# EAGLE board omniproto (EAGLE 6.6.0), part 1 of 3
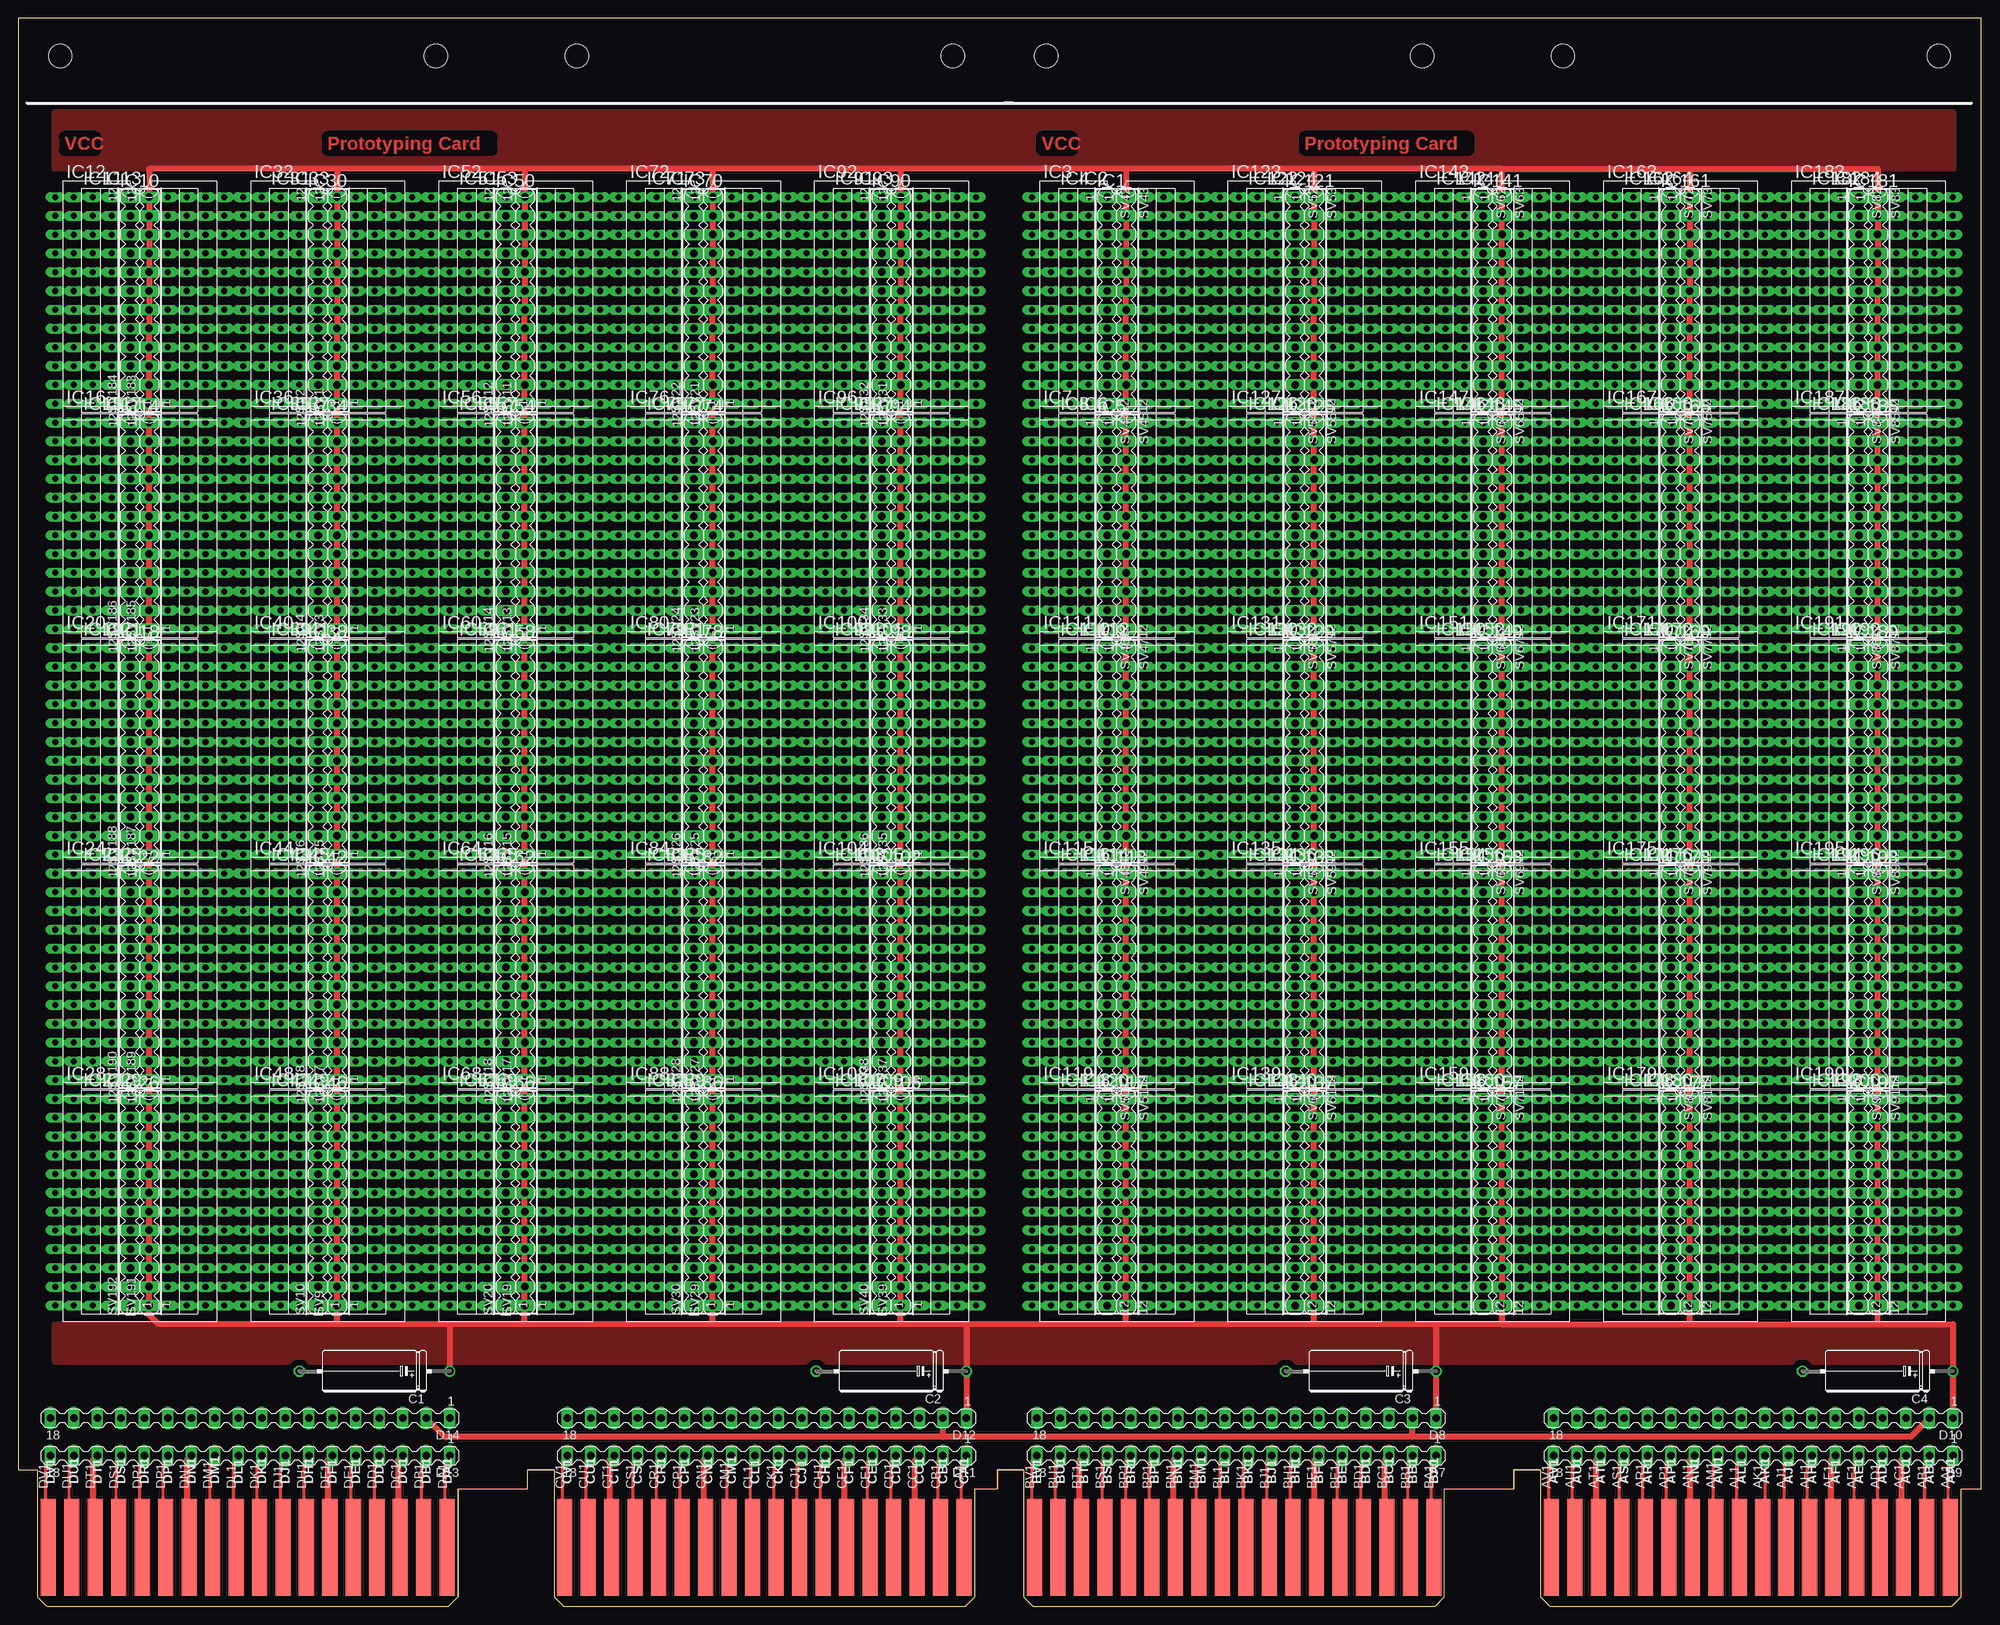
[diagram p3: board, top side]
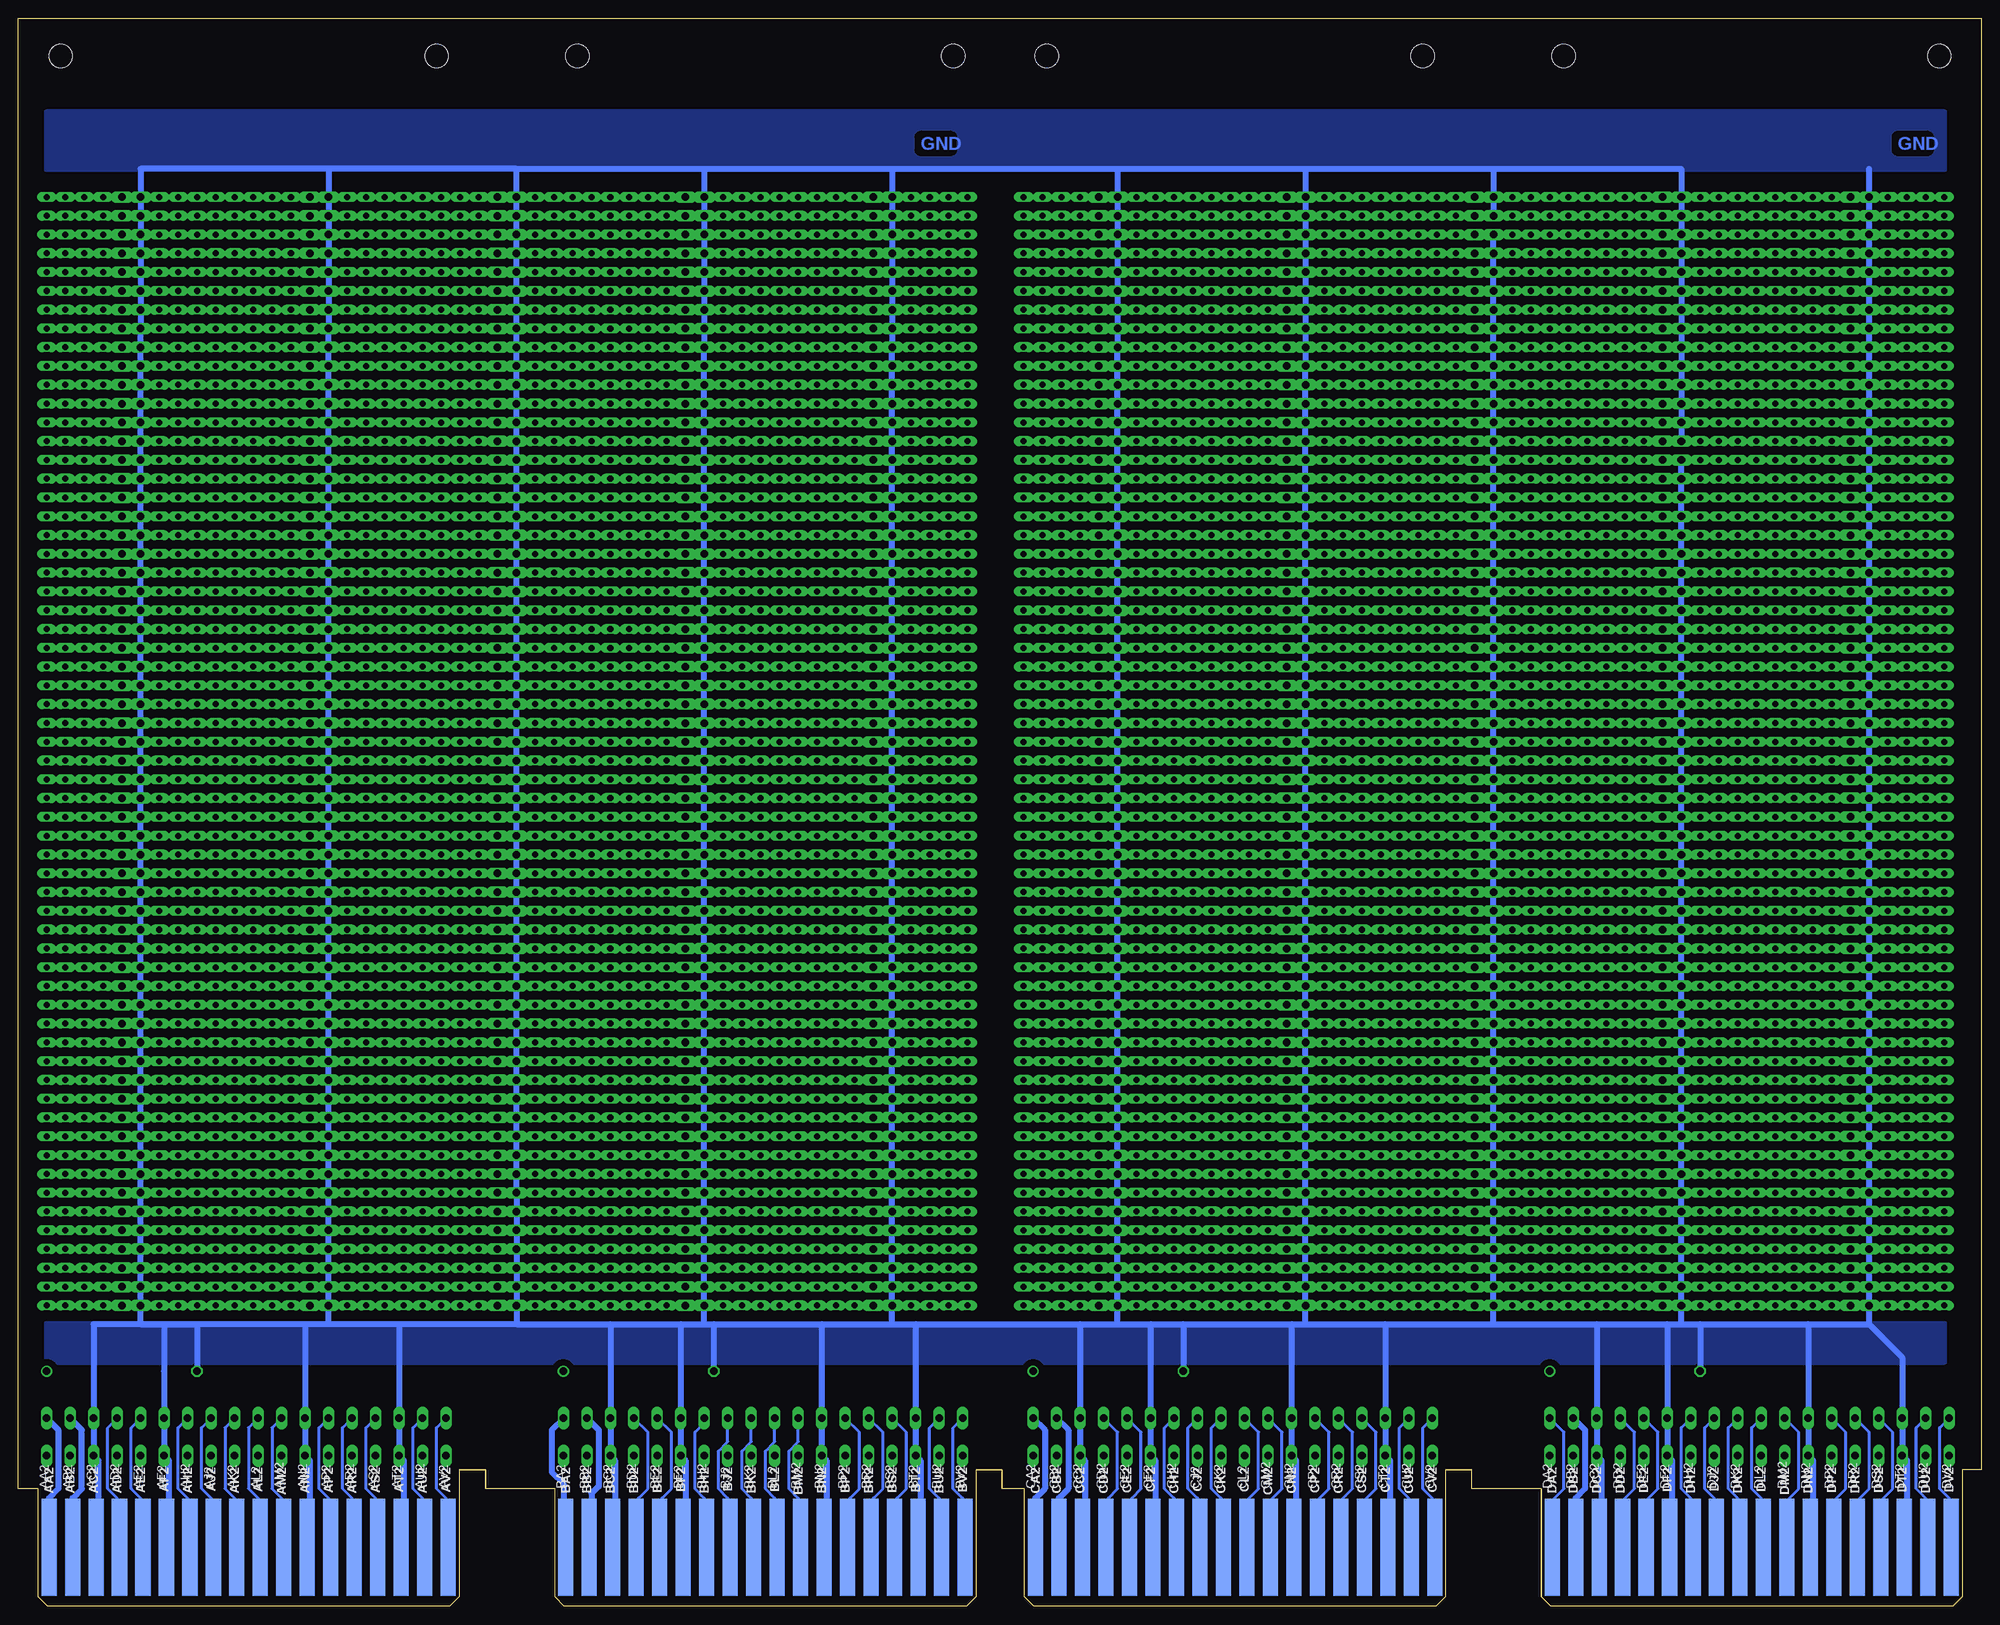
[diagram p4: board, bottom side, seen from below]

Size 265.3 x 214.63 mm. Coordinates in mm from the lower left corner, seen from the top.
Copper layers (1+16): Top 0.035mm / dielectric 1.5mm / Bottom 0.035mm
Design rules "16mils": minimum track width 16mil, minimum drill 32mil, track to track 15mil, track to pad 10mil, pad to pad 10mil, via to via 10mil, smd to smd 10mil, copper to edge 13mil, drill to drill 10mil, minimum pad ring 10mil, minimum via ring 8mil, stop-mask expansion 0mil, vias tented up to drill 0mil, thermal gap 10mil
Net classes: 1 supply: width 0.813 mm

## Footprints (pad centres in the part's own frame; a part is rotated, then mirrored left to right if it is on the bottom)
E12-8 = drill 1.016: + -10.16,0 | drill 1.016 octagon: - 10.16,0
MA18-1 = drill 1.016 long: 1 -25.4,0; 2 -22.225,0; 3 -19.05,0; 4 -15.875,0; 5 -12.7,0; 6 -9.525,0; 7 -6.35,0; 8 -3.175,0; 9 0,0; 10 3.175,0; 11 6.35,0; 12 9.525,0; 13 12.7,0; 14 15.875,0; 15 19.05,0; 16 22.225,0; 17 25.4,0; 18 28.575,0
DIL24-3 = drill 0.813 long: 1 -13.97,-3.81; 2 -11.43,-3.81; 3 -8.89,-3.81; 4 -6.35,-3.81; 5 -3.81,-3.81; 6 -1.27,-3.81; 7 1.27,-3.81; 8 3.81,-3.81; 9 6.35,-3.81; 10 8.89,-3.81; 11 11.43,-3.81; 12 13.97,-3.81; 13 13.97,3.81; 14 11.43,3.81; 15 8.89,3.81; 16 6.35,3.81; 17 3.81,3.81; 18 1.27,3.81; 19 -1.27,3.81; 20 -3.81,3.81; 21 -6.35,3.81; 22 -8.89,3.81; 23 -11.43,3.81; 24 -13.97,3.81
DIL24-6 = drill 0.813 long: 1 -13.97,-7.62; 2 -11.43,-7.62; 3 -8.89,-7.62; 4 -6.35,-7.62; 5 -3.81,-7.62; 6 -1.27,-7.62; 7 1.27,-7.62; 8 3.81,-7.62; 9 6.35,-7.62; 10 8.89,-7.62; 11 11.43,-7.62; 12 13.97,-7.62; 13 13.97,7.62; 14 11.43,7.62; 15 8.89,7.62; 16 6.35,7.62; 17 3.81,7.62; 18 1.27,7.62; 19 -1.27,7.62; 20 -3.81,7.62; 21 -6.35,7.62; 22 -8.89,7.62; 23 -11.43,7.62; 24 -13.97,7.62
DIL24-9 = drill 0.813 long: 1 -13.97,-11.43; 2 -11.43,-11.43; 3 -8.89,-11.43; 4 -6.35,-11.43; 5 -3.81,-11.43; 6 -1.27,-11.43; 7 1.27,-11.43; 8 3.81,-11.43; 9 6.35,-11.43; 10 8.89,-11.43; 11 11.43,-11.43; 12 13.97,-11.43; 13 13.97,11.43; 14 11.43,11.43; 15 8.89,11.43; 16 6.35,11.43; 17 3.81,11.43; 18 1.27,11.43; 19 -1.27,11.43; 20 -3.81,11.43; 21 -6.35,11.43; 22 -8.89,11.43; 23 -11.43,11.43; 24 -13.97,11.43
MA12-1 = drill 1.016 long: 1 -13.97,0; 2 -11.43,0; 3 -8.89,0; 4 -6.35,0; 5 -3.81,0; 6 -1.27,0; 7 1.27,0; 8 3.81,0; 9 6.35,0; 10 8.89,0; 11 11.43,0; 12 13.97,0
OMNIBUS = hole 3.175: 208.915,209.55; 259.715,209.55; 189.865,209.55; 139.065,209.55; 75.616,209.55; 126.416,209.55; 56.566,209.55; 5.766,209.55
EDGE-CON8 = smd 2.032 x 13.106: AA1 261.303,7.938; AB1 258.127,7.938; AC1 254.952,7.938; AD1 251.778,7.938; AE1 248.602,7.938; AF1 245.428,7.938; AH1 242.252,7.938; AJ1 239.077,7.938; AK1 235.903,7.938; AL1 232.727,7.938; AM1 229.553,7.938; AN1 226.377,7.938; AP1 223.202,7.938; AR1 220.028,7.938; AS1 216.852,7.938; AT1 213.678,7.938; AU1 210.502,7.938; AV1 207.327,7.938; BA1 191.452,7.938; BB1 188.278,7.938; BC1 185.102,7.938; BD1 181.928,7.938; BE1 178.752,7.938; BF1 175.577,7.938; BH1 172.403,7.938; BJ1 169.227,7.938; BK1 166.053,7.938; BL1 162.877,7.938; BM1 159.702,7.938; BN1 156.528,7.938; BP1 153.352,7.938; BR1 150.178,7.938; BS1 147.002,7.938; BT1 143.827,7.938; BU1 140.653,7.938; BV1 137.477,7.938; CA1 127.953,7.938; CB1 124.778,7.938; CC1 121.603,7.938; CD1 118.427,7.938; CE1 115.252,7.938; CF1 112.078,7.938; CH1 108.903,7.938; CJ1 105.728,7.938; CK1 102.552,7.938; CL1 99.377,7.938; CM1 96.203,7.938; CN1 93.028,7.938; CP1 89.853,7.938; CR1 86.677,7.938; CS1 83.502,7.938; CT1 80.328,7.938; CU1 77.153,7.938; CV1 73.978,7.938; DA1 58.102,7.938; DB1 54.928,7.938; DC1 51.752,7.938; DD1 48.578,7.938; DE1 45.403,7.938; DF1 42.227,7.938; DH1 39.053,7.938; DJ1 35.877,7.938; DK1 32.703,7.938; DL1 29.527,7.938; DM1 26.352,7.938; DN1 23.177,7.938; DP1 20.003,7.938; DR1 16.828,7.938; DS1 13.652,7.938; DT1 10.477,7.938; DU1 7.303,7.938; DV1 4.128,7.938 | smd 2.032 x 13.106 bottom: AA2 261.303,7.938; AB2 258.127,7.938; AC2 254.952,7.938; AD2 251.778,7.938; AE2 248.602,7.938; AF2 245.428,7.938; AH2 242.252,7.938; AJ2 239.077,7.938; AK2 235.903,7.938; AL2 232.727,7.938; AM2 229.553,7.938; AN2 226.377,7.938; AP2 223.202,7.938; AR2 220.028,7.938; AS2 216.852,7.938; AT2 213.678,7.938; AU2 210.502,7.938; AV2 207.327,7.938; BA2 191.452,7.938; BB2 188.278,7.938; BC2 185.102,7.938; BD2 181.928,7.938; BE2 178.752,7.938; BF2 175.577,7.938; BH2 172.403,7.938; BJ2 169.227,7.938; BK2 166.053,7.938; BL2 162.877,7.938; BM2 159.702,7.938; BN2 156.528,7.938; BP2 153.352,7.938; BR2 150.178,7.938; BS2 147.002,7.938; BT2 143.827,7.938; BU2 140.653,7.938; BV2 137.477,7.938; CA2 127.953,7.938; CB2 124.778,7.938; CC2 121.603,7.938; CD2 118.427,7.938; CE2 115.252,7.938; CF2 112.078,7.938; CH2 108.903,7.938; CJ2 105.728,7.938; CK2 102.552,7.938; CL2 99.377,7.938; CM2 96.203,7.938; CN2 93.028,7.938; CP2 89.853,7.938; CR2 86.677,7.938; CS2 83.502,7.938; CT2 80.328,7.938; CU2 77.153,7.938; CV2 73.978,7.938; DA2 58.102,7.938; DB2 54.928,7.938; DC2 51.752,7.938; DD2 48.578,7.938; DE2 45.403,7.938; DF2 42.227,7.938; DH2 39.053,7.938; DJ2 35.877,7.938; DK2 32.703,7.938; DL2 29.527,7.938; DM2 26.352,7.938; DN2 23.177,7.938; DP2 20.003,7.938; DR2 16.828,7.938; DS2 13.652,7.938; DT2 10.477,7.938; DU2 7.303,7.938; DV2 4.128,7.938

## Placement (x,y rotation side)
C1  [E12-8]  48.13,31.75 180 top
C2  [E12-8]  117.98,31.75 180 top
C3  [E12-8]  181.48,31.75 180 top
C4  [E12-8]  251.33,31.75 180 top
D7  MA18-1  [MA18-1]  166.24,20.32 180 top
D8  MA18-1  [MA18-1]  166.24,25.4 180 top
D9  MA18-1  [MA18-1]  236.09,20.32 180 top
D10  MA18-1  [MA18-1]  236.09,25.4 180 top
D11  MA18-1  [MA18-1]  102.74,20.32 180 top
D12  MA18-1  [MA18-1]  102.74,25.4 180 top
D13  MA18-1  [MA18-1]  32.89,20.32 180 top
D14  MA18-1  [MA18-1]  32.89,25.4 180 top
IC1  [DIL24-3]  148.46,176.53 270 top
IC2  [DIL24-6]  149.73,176.53 270 top
IC3  [DIL24-9]  148.46,176.53 270 top
IC4  [DIL24-6]  147.19,176.53 270 top
IC5  [DIL24-3]  148.46,146.05 270 top
IC6  [DIL24-6]  149.73,146.05 270 top
IC7  [DIL24-9]  148.46,146.05 270 top
IC8  [DIL24-6]  147.19,146.05 270 top
IC9  [DIL24-3]  148.46,115.57 270 top
IC10  [DIL24-3]  16.38,176.53 270 top
IC11  [DIL24-6]  15.11,176.53 270 top
IC12  [DIL24-9]  16.38,176.53 270 top
IC13  [DIL24-6]  17.65,176.53 270 top
IC14  [DIL24-3]  16.38,146.05 270 top
IC15  [DIL24-6]  15.11,146.05 270 top
IC16  [DIL24-9]  16.38,146.05 270 top
IC17  [DIL24-6]  17.65,146.05 270 top
IC18  [DIL24-3]  16.38,115.57 270 top
IC19  [DIL24-6]  15.11,115.57 270 top
IC20  [DIL24-9]  16.38,115.57 270 top
IC21  [DIL24-6]  17.65,115.57 270 top
IC22  [DIL24-3]  16.38,85.09 270 top
IC23  [DIL24-6]  15.11,85.09 270 top
IC24  [DIL24-9]  16.38,85.09 270 top
IC25  [DIL24-6]  17.65,85.09 270 top
IC26  [DIL24-3]  16.38,54.61 270 top
IC27  [DIL24-6]  15.11,54.61 270 top
IC28  [DIL24-9]  16.38,54.61 270 top
IC29  [DIL24-6]  17.65,54.61 270 top
IC30  [DIL24-3]  41.78,176.53 270 top
IC31  [DIL24-6]  40.51,176.53 270 top
IC32  [DIL24-9]  41.78,176.53 270 top
IC33  [DIL24-6]  43.05,176.53 270 top
IC34  [DIL24-3]  41.78,146.05 270 top
IC35  [DIL24-6]  40.51,146.05 270 top
IC36  [DIL24-9]  41.78,146.05 270 top
IC37  [DIL24-6]  43.05,146.05 270 top
IC38  [DIL24-3]  41.78,115.57 270 top
IC39  [DIL24-6]  40.51,115.57 270 top
IC40  [DIL24-9]  41.78,115.57 270 top
IC41  [DIL24-6]  43.05,115.57 270 top
IC42  [DIL24-3]  41.78,85.09 270 top
IC43  [DIL24-6]  40.51,85.09 270 top
IC44  [DIL24-9]  41.78,85.09 270 top
IC45  [DIL24-6]  43.05,85.09 270 top
IC46  [DIL24-3]  41.78,54.61 270 top
IC47  [DIL24-6]  40.51,54.61 270 top
IC48  [DIL24-9]  41.78,54.61 270 top
IC49  [DIL24-6]  43.05,54.61 270 top
IC50  [DIL24-3]  67.18,176.53 270 top
IC51  [DIL24-6]  65.91,176.53 270 top
IC52  [DIL24-9]  67.18,176.53 270 top
IC53  [DIL24-6]  68.45,176.53 270 top
IC54  [DIL24-3]  67.18,146.05 270 top
IC55  [DIL24-6]  65.91,146.05 270 top
IC56  [DIL24-9]  67.18,146.05 270 top
IC57  [DIL24-6]  68.45,146.05 270 top
IC58  [DIL24-3]  67.18,115.57 270 top
IC59  [DIL24-6]  65.91,115.57 270 top
IC60  [DIL24-9]  67.18,115.57 270 top
IC61  [DIL24-6]  68.45,115.57 270 top
IC62  [DIL24-3]  67.18,85.09 270 top
IC63  [DIL24-6]  65.91,85.09 270 top
IC64  [DIL24-9]  67.18,85.09 270 top
IC65  [DIL24-6]  68.45,85.09 270 top
IC66  [DIL24-3]  67.18,54.61 270 top
IC67  [DIL24-6]  65.91,54.61 270 top
IC68  [DIL24-9]  67.18,54.61 270 top
IC69  [DIL24-6]  68.45,54.61 270 top
IC70  [DIL24-3]  92.58,176.53 270 top
IC71  [DIL24-6]  91.31,176.53 270 top
IC72  [DIL24-9]  92.58,176.53 270 top
IC73  [DIL24-6]  93.85,176.53 270 top
IC74  [DIL24-3]  92.58,146.05 270 top
IC75  [DIL24-6]  91.31,146.05 270 top
IC76  [DIL24-9]  92.58,146.05 270 top
IC77  [DIL24-6]  93.85,146.05 270 top
IC78  [DIL24-3]  92.58,115.57 270 top
IC79  [DIL24-6]  91.31,115.57 270 top
IC80  [DIL24-9]  92.58,115.57 270 top
IC81  [DIL24-6]  93.85,115.57 270 top
IC82  [DIL24-3]  92.58,85.09 270 top
IC83  [DIL24-6]  91.31,85.09 270 top
IC84  [DIL24-9]  92.58,85.09 270 top
IC85  [DIL24-6]  93.85,85.09 270 top
IC86  [DIL24-3]  92.58,54.61 270 top
IC87  [DIL24-6]  91.31,54.61 270 top
IC88  [DIL24-9]  92.58,54.61 270 top
IC89  [DIL24-6]  93.85,54.61 270 top
IC90  [DIL24-3]  117.98,176.53 270 top
IC91  [DIL24-6]  116.71,176.53 270 top
IC92  [DIL24-9]  117.98,176.53 270 top
IC93  [DIL24-6]  119.25,176.53 270 top
IC94  [DIL24-3]  117.98,146.05 270 top
IC95  [DIL24-6]  116.71,146.05 270 top
IC96  [DIL24-9]  117.98,146.05 270 top
IC97  [DIL24-6]  119.25,146.05 270 top
IC98  [DIL24-3]  117.98,115.57 270 top
IC99  [DIL24-6]  116.71,115.57 270 top
IC100  [DIL24-9]  117.98,115.57 270 top
IC101  [DIL24-6]  119.25,115.57 270 top
IC102  [DIL24-3]  117.98,85.09 270 top
IC103  [DIL24-6]  116.71,85.09 270 top
IC104  [DIL24-9]  117.98,85.09 270 top
IC105  [DIL24-6]  119.25,85.09 270 top
IC106  [DIL24-3]  117.98,54.61 270 top
IC107  [DIL24-6]  116.71,54.61 270 top
IC108  [DIL24-9]  117.98,54.61 270 top
IC109  [DIL24-6]  119.25,54.61 270 top
IC110  [DIL24-6]  147.19,115.57 270 top
IC111  [DIL24-9]  148.46,115.57 270 top
IC112  [DIL24-6]  149.73,115.57 270 top
IC113  [DIL24-3]  148.46,85.09 270 top
IC114  [DIL24-6]  149.73,85.09 270 top
IC115  [DIL24-9]  148.46,85.09 270 top
IC116  [DIL24-6]  147.19,85.09 270 top
IC117  [DIL24-3]  148.46,54.61 270 top
IC118  [DIL24-6]  147.19,54.61 270 top
IC119  [DIL24-9]  148.46,54.61 270 top
IC120  [DIL24-6]  149.73,54.61 270 top
IC121  [DIL24-3]  173.86,176.53 270 top
IC122  [DIL24-6]  172.59,176.53 270 top
IC123  [DIL24-9]  173.86,176.53 270 top
IC124  [DIL24-6]  175.13,176.53 270 top
IC125  [DIL24-3]  173.86,146.05 270 top
IC126  [DIL24-6]  172.59,146.05 270 top
IC127  [DIL24-9]  173.86,146.05 270 top
IC128  [DIL24-6]  175.13,146.05 270 top
IC129  [DIL24-3]  173.86,115.57 270 top
IC130  [DIL24-6]  172.59,115.57 270 top
IC131  [DIL24-9]  173.86,115.57 270 top
IC132  [DIL24-6]  175.13,115.57 270 top
IC133  [DIL24-3]  173.86,85.09 270 top
IC134  [DIL24-6]  172.59,85.09 270 top
IC135  [DIL24-9]  173.86,85.09 270 top
IC136  [DIL24-6]  175.13,85.09 270 top
IC137  [DIL24-3]  173.86,54.61 270 top
IC138  [DIL24-6]  172.59,54.61 270 top
IC139  [DIL24-9]  173.86,54.61 270 top
IC140  [DIL24-6]  175.13,54.61 270 top
IC141  [DIL24-3]  199.26,176.53 270 top
IC142  [DIL24-6]  197.99,176.53 270 top
IC143  [DIL24-9]  199.26,176.53 270 top
IC144  [DIL24-6]  200.53,176.53 270 top
IC145  [DIL24-3]  199.26,146.05 270 top
IC146  [DIL24-6]  197.99,146.05 270 top
IC147  [DIL24-9]  199.26,146.05 270 top
IC148  [DIL24-6]  200.53,146.05 270 top
IC149  [DIL24-3]  199.26,115.57 270 top
IC150  [DIL24-6]  197.99,115.57 270 top
IC151  [DIL24-9]  199.26,115.57 270 top
IC152  [DIL24-6]  200.53,115.57 270 top
IC153  [DIL24-3]  199.26,85.09 270 top
IC154  [DIL24-6]  197.99,85.09 270 top
IC155  [DIL24-9]  199.26,85.09 270 top
IC156  [DIL24-6]  200.53,85.09 270 top
IC157  [DIL24-3]  199.26,54.61 270 top
IC158  [DIL24-6]  197.99,54.61 270 top
IC159  [DIL24-9]  199.26,54.61 270 top
IC160  [DIL24-6]  200.53,54.61 270 top
IC161  [DIL24-3]  224.66,176.53 270 top
IC162  [DIL24-6]  223.39,176.53 270 top
IC163  [DIL24-9]  224.66,176.53 270 top
IC164  [DIL24-6]  225.93,176.53 270 top
IC165  [DIL24-3]  224.66,146.05 270 top
IC166  [DIL24-6]  223.39,146.05 270 top
IC167  [DIL24-9]  224.66,146.05 270 top
IC168  [DIL24-6]  225.93,146.05 270 top
IC169  [DIL24-3]  224.66,115.57 270 top
IC170  [DIL24-6]  223.39,115.57 270 top
IC171  [DIL24-9]  224.66,115.57 270 top
IC172  [DIL24-6]  225.93,115.57 270 top
IC173  [DIL24-3]  224.66,85.09 270 top
IC174  [DIL24-6]  223.39,85.09 270 top
IC175  [DIL24-9]  224.66,85.09 270 top
IC176  [DIL24-6]  225.93,85.09 270 top
IC177  [DIL24-3]  224.66,54.61 270 top
IC178  [DIL24-6]  223.39,54.61 270 top
IC179  [DIL24-9]  224.66,54.61 270 top
IC180  [DIL24-6]  225.93,54.61 270 top
IC181  [DIL24-3]  250.06,176.53 270 top
IC182  [DIL24-6]  248.79,176.53 270 top
IC183  [DIL24-9]  250.06,176.53 270 top
IC184  [DIL24-6]  251.33,176.53 270 top
IC185  [DIL24-3]  250.06,146.05 270 top
IC186  [DIL24-6]  248.79,146.05 270 top
IC187  [DIL24-9]  250.06,146.05 270 top
IC188  [DIL24-6]  251.33,146.05 270 top
IC189  [DIL24-3]  250.06,115.57 270 top
IC190  [DIL24-6]  248.79,115.57 270 top
IC191  [DIL24-9]  250.06,115.57 270 top
IC192  [DIL24-6]  251.33,115.57 270 top
IC193  [DIL24-3]  250.06,85.09 270 top
IC194  [DIL24-6]  248.79,85.09 270 top
IC195  [DIL24-9]  250.06,85.09 270 top
IC196  [DIL24-6]  251.33,85.09 270 top
IC197  [DIL24-3]  250.06,54.61 270 top
IC198  [DIL24-6]  248.79,54.61 270 top
IC199  [DIL24-9]  250.06,54.61 270 top
IC200  [DIL24-6]  251.33,54.61 270 top
SV1  [MA12-1]  43.05,176.53 90 top
SV2  [MA12-1]  40.51,176.53 90 top
SV3  [MA12-1]  43.05,146.05 90 top
SV4  [MA12-1]  40.51,146.05 90 top
SV5  [MA12-1]  43.05,115.57 90 top
SV6  [MA12-1]  40.51,115.57 90 top
SV7  [MA12-1]  43.05,85.09 90 top
SV8  [MA12-1]  40.51,85.09 90 top
SV9  [MA12-1]  43.05,54.61 90 top
SV10  [MA12-1]  40.51,54.61 90 top
SV11  [MA12-1]  68.45,176.53 90 top
SV12  [MA12-1]  65.91,176.53 90 top
SV13  [MA12-1]  68.45,146.05 90 top
SV14  [MA12-1]  65.91,146.05 90 top
SV15  [MA12-1]  68.45,115.57 90 top
SV16  [MA12-1]  65.91,115.57 90 top
SV17  [MA12-1]  68.45,85.09 90 top
SV18  [MA12-1]  65.91,85.09 90 top
SV19  [MA12-1]  68.45,54.61 90 top
SV20  [MA12-1]  65.91,54.61 90 top
SV21  [MA12-1]  93.85,176.53 90 top
SV22  [MA12-1]  91.31,176.53 90 top
SV23  [MA12-1]  93.85,146.05 90 top
SV24  [MA12-1]  91.31,146.05 90 top
SV25  [MA12-1]  93.85,115.57 90 top
SV26  [MA12-1]  91.31,115.57 90 top
SV27  [MA12-1]  93.85,85.09 90 top
SV28  [MA12-1]  91.31,85.09 90 top
SV29  [MA12-1]  93.85,54.61 90 top
SV30  [MA12-1]  91.31,54.61 90 top
SV31  [MA12-1]  119.25,176.53 90 top
SV32  [MA12-1]  116.71,176.53 90 top
SV33  [MA12-1]  119.25,146.05 90 top
SV34  [MA12-1]  116.71,146.05 90 top
SV35  [MA12-1]  119.25,115.57 90 top
SV36  [MA12-1]  116.71,115.57 90 top
SV37  [MA12-1]  119.25,85.09 90 top
SV38  [MA12-1]  116.71,85.09 90 top
SV39  [MA12-1]  119.25,54.61 90 top
SV40  [MA12-1]  116.71,54.61 90 top
SV42  [MA12-1]  147.19,176.53 270 top
SV43  [MA12-1]  149.73,176.53 270 top
SV44  [MA12-1]  147.19,146.05 270 top
SV45  [MA12-1]  149.73,146.05 270 top
SV46  [MA12-1]  147.19,115.57 270 top
SV47  [MA12-1]  149.73,115.57 270 top
SV48  [MA12-1]  147.19,85.09 270 top
SV49  [MA12-1]  149.73,85.09 270 top
SV50  [MA12-1]  147.19,54.61 270 top
SV51  [MA12-1]  149.73,54.61 270 top
SV52  [MA12-1]  172.59,176.53 270 top
SV53  [MA12-1]  175.13,176.53 270 top
SV54  [MA12-1]  172.59,146.05 270 top
SV55  [MA12-1]  175.13,146.05 270 top
SV56  [MA12-1]  172.59,115.57 270 top
SV57  [MA12-1]  175.13,115.57 270 top
SV58  [MA12-1]  172.59,85.09 270 top
SV59  [MA12-1]  175.13,85.09 270 top
SV60  [MA12-1]  172.59,54.61 270 top
SV61  [MA12-1]  175.13,54.61 270 top
SV62  [MA12-1]  197.99,176.53 270 top
SV63  [MA12-1]  200.53,176.53 270 top
SV64  [MA12-1]  197.99,146.05 270 top
SV65  [MA12-1]  200.53,146.05 270 top
SV66  [MA12-1]  197.99,115.57 270 top
SV67  [MA12-1]  200.53,115.57 270 top
SV68  [MA12-1]  197.99,85.09 270 top
SV69  [MA12-1]  200.53,85.09 270 top
SV70  [MA12-1]  197.99,54.61 270 top
SV71  [MA12-1]  200.53,54.61 270 top
SV72  [MA12-1]  223.39,176.53 270 top
SV73  [MA12-1]  225.93,176.53 270 top
SV74  [MA12-1]  223.39,146.05 270 top
SV75  [MA12-1]  225.93,146.05 270 top
SV76  [MA12-1]  223.39,115.57 270 top
SV77  [MA12-1]  225.93,115.57 270 top
SV78  [MA12-1]  223.39,85.09 270 top
SV79  [MA12-1]  225.93,85.09 270 top
SV80  [MA12-1]  223.39,54.61 270 top
SV81  [MA12-1]  225.93,54.61 270 top
SV82  [MA12-1]  248.79,176.53 270 top
SV83  [MA12-1]  251.33,176.53 270 top
SV84  [MA12-1]  248.79,146.05 270 top
SV85  [MA12-1]  251.33,146.05 270 top
SV86  [MA12-1]  248.79,115.57 270 top
SV87  [MA12-1]  251.33,115.57 270 top
SV88  [MA12-1]  248.79,85.09 270 top
SV89  [MA12-1]  251.33,85.09 270 top
SV90  [MA12-1]  248.79,54.61 270 top
SV91  [MA12-1]  251.33,54.61 270 top
SV183  [MA12-1]  17.65,176.53 90 top
SV184  [MA12-1]  15.11,176.53 90 top
SV185  [MA12-1]  17.65,146.05 90 top
SV186  [MA12-1]  15.11,146.05 90 top
SV187  [MA12-1]  17.65,115.57 90 top
SV188  [MA12-1]  15.11,115.57 90 top
SV189  [MA12-1]  17.65,85.09 90 top
SV190  [MA12-1]  15.11,85.09 90 top
SV191  [MA12-1]  17.65,54.61 90 top
SV192  [MA12-1]  15.11,54.61 90 top
U$1  OUTLINE-OMNIBUS  [OMNIBUS]  -0.13,0 0 top
U$2  [EDGE-CON8]  -0.13,0 0 top

## Tracks (layer width: path | path; a pad name or v marks a point on that pad's centre or on a via)
!BREAK_CYCLE
  Bottom 0.406: D8.10 163.07,22.23 164.34,20.95 164.34,15.88 163.07,14.61 U$2.BL2
!BRK_DATA_CONT
  Bottom 0.406: D8.9 166.24,22.23 167.51,20.95 167.51,15.88 166.24,14.61 U$2.BK2
!BRK_IN_PROG
  Bottom 0.406: D8.5 177.04,23.5 177.04,15.88 178.31,14.61 U$2.BE2
!BUS_STROBE
  Top 0.406: D11.9 102.11,19.68 102.11,13.97 U$2.CK1
!C0
  Top 0.406: D11.5 114.81,19.68 114.81,13.97 U$2.CE1
!C1
  Top 0.406: D11.7 108.46,19.68 108.46,13.97 U$2.CH1
!C2
  Top 0.406: D11.8 105.28,19.68 105.28,13.97 U$2.CJ1
!CPMA_DISABLE
  Top 0.406: D11.17 76.71,19.68 76.71,13.97 U$2.CU1
!D
  Bottom 0.406: D14.9 34.16,24.13 34.16,15.88 32.89,14.61 U$2.DK2
!DATA0
  Top 0.406: D9.14 219.58,19.68 219.58,13.97 U$2.AR1
!DATA1
  Top 0.406: D9.15 216.41,19.68 216.41,13.97 U$2.AS1
!DATA2
  Top 0.406: D9.17 210.06,19.68 210.06,13.97 U$2.AU1
!DATA3
  Top 0.406: D9.18 206.88,19.68 206.88,13.97 U$2.AV1
!DATA4
  Top 0.406: D7.14 149.73,19.68 149.73,13.97 U$2.BR1
!DATA5
  Top 0.406: D7.15 146.56,19.68 146.56,13.97 U$2.BS1
!DATA6
  Top 0.406: D7.17 140.21,19.68 140.21,13.97 U$2.BU1
!DATA7
  Top 0.406: D7.18 137.03,19.68 137.03,13.97 U$2.BV1
!DATA8
  Top 0.406: D13.14 16.38,19.68 16.38,13.97 U$2.DR1
!DATA9
  Top 0.406: D13.15 13.21,19.68 13.21,13.97 U$2.DS1
!DATA10
  Top 0.406: D13.17 6.86,19.68 6.86,13.97 U$2.DU1
!DATA11
  Top 0.406: D13.18 3.68,19.68 3.68,13.97 U$2.DV1
!E
  Bottom 0.406: D14.10 30.99,24.13 30.99,15.88 29.72,14.61 U$2.DL2
!EMA0
  Bottom 0.406: D10.4 253.24,24.13 253.24,15.88 251.97,14.61 U$2.AD2
!EMA1
  Bottom 0.406: D10.5 250.06,24.13 250.06,15.88 248.79,14.61 U$2.AE2
!EMA2
  Bottom 0.406: D10.7 243.71,24.13 243.71,15.88 242.44,14.61 U$2.AH2
!F
  Bottom 0.406: D14.8 37.34,24.13 37.34,15.88 36.07,14.61 U$2.DJ2
!FSET
  Bottom 0.406: D14.13 18.29,23.5 18.29,15.88 19.56,14.61 U$2.DP2
!IND1
  Bottom 0.406: D12.17 78.61,24.13 78.61,15.88 77.34,14.61 U$2.CU2
!IND2
  Bottom 0.406: D12.18 75.44,24.13 75.44,15.88 74.17,14.61 U$2.CV2
!INT_RQST
  Top 0.406: D11.13 89.41,19.68 89.41,13.97 U$2.CP1
!INTERNAL_IO
  Top 0.406: D11.10 98.93,19.68 98.93,13.97 U$2.CL1
!IO_PAUSE
  Top 0.406: D11.4 117.98,19.68 117.98,13.97 U$2.CD1
!IR0
  Bottom 0.406: D14.4 46.86,23.5 46.86,15.88 48.13,14.61 U$2.DD2
!IR1
  Bottom 0.406: D14.5 43.69,23.5 43.69,15.88 44.96,14.61 U$2.DE2
!IR2
  Bottom 0.406: D14.7 40.51,24.13 40.51,15.88 39.24,14.61 U$2.DH2
!KEY_CONT
  Bottom 0.406: D14.17 8.76,24.13 8.76,15.88 7.49,14.61 U$2.DU2
!LA_ENABLE
  Bottom 0.406: D8.11 159.89,22.23 161.16,20.95 161.16,15.88 159.89,14.61 U$2.BM2
!LINK
  Bottom 0.406: D10.18 208.79,24.13 208.79,15.88 207.52,14.61 U$2.AV2
!LINK_DATA
  Bottom 0.406: D12.14 84.96,23.5 84.96,15.88 86.23,14.61 U$2.CR2
!LINK_LOAD
  Bottom 0.406: D12.15 81.79,23.5 81.79,15.88 83.06,14.61 U$2.CS2
!LOAD_CONT
  Bottom 0.406: D8.7 172.59,24.77 173.86,23.5 173.86,15.88 172.59,14.61 U$2.BH2
!MA00
  Top 0.406: D9.4 251.33,19.68 251.33,13.97 U$2.AD1
!MA01
  Top 0.406: D9.5 248.16,19.68 248.16,13.97 U$2.AE1
!MA02
  Top 0.406: D9.7 241.81,19.68 241.81,13.97 U$2.AH1
!MA03
  Top 0.406: D9.8 238.63,19.68 238.63,13.97 U$2.AJ1
!MA04
  Top 0.406: D7.4 181.48,19.68 181.48,13.97 U$2.BD1
!MA05
  Top 0.406: D7.5 178.31,19.68 178.31,13.97 U$2.BE1
!MA06
  Top 0.406: D7.7 171.96,19.68 171.96,13.97 U$2.BH1
!MA07
  Top 0.406: D7.8 168.78,19.68 168.78,13.97 U$2.BJ1
!MA08
  Top 0.406: D13.4 48.13,19.68 48.13,13.97 U$2.DD1
!MA09
  Top 0.406: D13.5 44.96,19.68 44.96,13.97 U$2.DE1
!MA10
  Top 0.406: D13.7 38.61,19.68 38.61,13.97 U$2.DH1
!MA11
  Top 0.406: D13.8 35.43,19.68 35.43,13.97 U$2.DJ1
!MD00
  Top 0.406: U$2.AK1 236.09,13.97 D9.9
!MD01
  Top 0.406: U$2.AL1 232.28,13.97 232.28,19.68 D9.10
!MD02
  Top 0.406: U$2.AM1 229.11,13.97 229.11,19.68 D9.11
!MD03
  Top 0.406: U$2.AP1 222.76,13.97 222.76,19.68 D9.13
!MD04
  Top 0.406: U$2.BK1 165.61,13.97 165.61,19.68 D7.9
!MD05
  Top 0.406: U$2.BL1 162.43,13.97 162.43,19.68 D7.10
!MD06
  Top 0.406: U$2.BM1 159.26,13.97 159.26,19.68 D7.11
!MD07
  Top 0.406: U$2.BP1 152.91,13.97 152.91,19.68 D7.13
!MD08
  Top 0.406: U$2.DK1 32.26,13.97 32.26,19.68 D13.9
!MD09
  Top 0.406: U$2.DL1 29.08,13.97 29.08,19.68 D13.10
!MD10
  Top 0.406: U$2.DM1 25.91,13.97 25.91,19.68 D13.11
!MD11
  Top 0.406: U$2.DP1 19.56,13.97 19.56,19.68 D13.13
!MD_DIR
  Bottom 0.406: D10.9 237.36,24.13 237.36,15.88 236.09,14.61 U$2.AK2
!MEM_START
  Bottom 0.406: D10.8 240.54,24.13 240.54,15.88 239.27,14.61 U$2.AJ2
!MS_DISABLE
  Top 0.406: D11.18 73.53,19.68 73.53,13.97 U$2.CV1
!NOT_LAST_TR
  Top 0.406: D11.11 95.76,19.68 95.76,13.97 U$2.CM1
!NTS_STALL
  Bottom 0.406: D8.14 148.46,23.5 148.46,15.88 149.73,14.61 U$2.BR2
!OVERFLOW
  Bottom 0.406: D8.8 169.42,22.23 170.69,20.95 170.69,15.88 169.42,14.61 U$2.BJ2
!ROM_ADDR
  Bottom 0.406: U$2.AU2 210.69,14.61 211.96,15.88 211.96,24.13 D10.17
!RUN
  Bottom 0.406: D8.17 142.11,24.13 142.11,15.88 140.84,14.61 U$2.BU2
!SKIP
  Top 0.406: D11.15 83.06,19.68 83.06,13.97 U$2.CS1
!STOP
  Bottom 0.406: D14.15 11.94,23.5 11.94,15.88 13.21,14.61 U$2.DS2
!TS1
  Bottom 0.406: D12.9 104.01,24.13 104.01,15.88 102.74,14.61 U$2.CK2
!TS2
  Bottom 0.406: D12.10 97.66,23.5 97.66,15.88 98.93,14.61 U$2.CL2
!TS3
  Bottom 0.406: D12.11 94.49,23.5 94.49,15.88 95.76,14.61 U$2.CM2
!TS4
  Bottom 0.406: D12.13 88.14,23.5 88.14,15.88 89.41,14.61 U$2.CP2
!USER_MODE
  Bottom 0.406: D14.11 24.64,23.5 24.64,15.88 25.91,14.61 U$2.DM2
+15V
  Bottom 0.406: D14.1 56.39,23.5 56.39,15.88 57.66,14.61 U$2.DA2
-15V
  Top 0.813: 124.97,22.86 57.66,22.86 D14.2 | 124.97,22.86 D12.2 | 188.47,22.86 124.97,22.86 | 188.47,22.86 D8.2 | 188.47,22.86 255.78,22.86 D10.2
  Bottom 0.813: D10.2 256.73,23.81 256.73,15.88 258,14.61 U$2.AB2 | D8.2 186.88,23.81 186.88,16.19 187.83,15.24 U$2.BB2 | D14.2 53.53,23.81 53.53,15.88 54.8,14.61 U$2.DB2 | D12.2 123.38,23.81 123.38,15.88 124.65,14.61 U$2.CB2
GND
  Top 0.813: D11.12 92.58,19.68 92.58,13.97 U$2.CN2 | D13.6 41.78,19.68 41.78,13.97 U$2.DF2 | D13.3 51.31,19.68 51.31,13.97 U$2.DC2 | D11.16 79.88,19.68 79.88,13.97 U$2.CT2 | D9.3 254.51,19.68 254.51,13.97 U$2.AC1 | U$2.AF2 244.98,13.97 244.98,19.68 D9.6 | D9.16 213.23,19.68 213.23,13.97 U$2.AT2 | U$2.BC1 184.66,13.97 184.66,19.68 D7.3 | D9.12 225.93,19.68 225.93,13.97 U$2.AN2 | D7.6 175.13,19.68 175.13,13.97 U$2.BF2 | D7.12 156.08,19.68 156.08,13.97 U$2.BN2 | D7.16 143.38,19.68 143.38,13.97 U$2.BT2 | D11.6 111.63,19.68 111.63,13.97 U$2.CF2 | D11.3 121.16,19.68 121.16,13.97 U$2.CC2 | D13.12 22.73,19.68 22.73,13.97 U$2.DN2 | D13.16 10.03,19.68 10.03,13.97 U$2.DT2
  Bottom 0.813: 93.22,38.1 D12.12 D11.12 92.58,19.68 92.58,13.97 U$2.CN2 | U$2.DF2 41.78,13.97 41.78,19.68 D13.6 D14.6 42.42,38.1 | U$2.DC2 51.31,13.97 51.31,19.68 D13.3 D14.3 51.94,38.1 | U$2.CT2 79.88,13.97 79.88,19.68 D11.16 D12.16 80.52,38.1 | U$2.AC1 254.51,13.97 254.51,19.68 D9.3 D10.3 255.14,38.1 248.79,38.1 | U$2.AF2 244.98,13.97 244.98,19.68 D9.6 D10.6 245.62,31.75 245.62,38.1 | U$2.AT2 213.23,13.97 213.23,19.68 D9.16 D10.16 213.87,38.1 | U$2.BC1 184.66,13.97 184.66,19.68 D7.3 D8.3 185.29,38.1 | U$2.AN2 225.93,13.97 225.93,19.68 D9.12 D10.12 226.57,38.1 | U$2.BF2 175.13,13.97 175.13,19.68 D7.6 D8.6 175.77,38.1 | U$2.BN2 156.08,13.97 156.08,19.68 D7.12 D8.12 156.72,38.1 | U$2.BT2 143.38,13.97 143.38,19.68 D7.16 D8.16 144.02,38.1 147.19,38.1 | U$2.CF2 111.63,13.97 111.63,19.68 D11.6 D12.6 112.27,38.1 | U$2.CC2 121.16,13.97 121.16,19.68 D11.3 D12.3 121.79,38.1 | U$2.DN2 22.73,13.97 22.73,19.68 D13.12 D14.12 23.37,38.1 | U$2.DT2 10.03,13.97 10.03,19.68 D13.16 D14.16 10.67,33.66 15.11,38.1 | 15.11,38.1 SV192.1 SV192.2 SV192.3 SV192.4 SV192.5 SV192.6 SV192.7 SV192.8 SV192.9 SV192.10 SV192.11 SV192.12 SV190.1 SV190.2 SV190.3 SV190.4 SV190.5 SV190.6 SV190.7 SV190.8 SV190.9 SV190.10 SV190.11 SV190.12 SV188.1 SV188.2 SV188.3 SV188.4 SV188.5 SV188.6 SV188.7 SV188.8 SV188.9 SV188.10 SV188.11 SV188.12 SV186.1 SV186.2 SV186.3 SV186.4 SV186.5 SV186.6 SV186.7 SV186.8 SV186.9 SV186.10 SV186.11 SV186.12 SV184.1 SV184.2 SV184.3 SV184.4 SV184.5 SV184.6 SV184.7 SV184.8 SV184.9 SV184.10 SV184.11 SV184.12 15.11,194.31 | 112.27,38.1 93.22,38.1 | 40.51,38.1 SV10.1 SV10.2 SV10.3 SV10.4 SV10.5 SV10.6 SV10.7 SV10.8 SV10.9 SV10.10 SV10.11 SV10.12 SV8.1 SV8.2 SV8.3 SV8.4 SV8.5 SV8.6 SV8.7 SV8.8 SV8.9 SV8.10 SV8.11 SV8.12 SV6.1 SV6.2 SV6.3 SV6.4 SV6.5 SV6.6 SV6.7 SV6.8 SV6.9 SV6.10 SV6.11 SV6.12 SV4.1 SV4.2 SV4.3 SV4.4 SV4.5 SV4.6 SV4.7 SV4.8 SV4.9 SV4.10
  Bottom 0.813: 42.42,38.1 40.51,38.1 | 40.51,38.1 23.37,38.1 | 23.37,38.1 15.11,38.1 | 51.94,38.1 42.42,38.1 | 65.91,38.1 51.94,38.1 | 80.52,38.1 65.91,38.1 | 91.31,38.1 80.52,38.1 | 93.22,38.1 91.31,38.1 | 116.71,38.1 112.27,38.1 | 121.79,38.1 116.71,38.1 | 65.91,194.31 40.51,194.31 SV2.12 SV2.11 SV2.10 SV2.9 SV2.8 SV2.7 SV2.6 SV2.5 SV2.4 SV2.3 SV2.2 SV2.1 SV4.12 SV4.11 | 147.19,38.1 121.79,38.1 | 91.31,194.31 65.91,194.31 | 213.87,38.1 223.39,38.1 | 223.39,38.1 226.57,38.1 | 226.57,38.1 248.79,38.1 | 185.29,38.1 175.77,38.1 | 197.99,38.1 185.29,38.1 | 197.99,38.1 213.87,38.1 | SV12.10 SV12.9 SV12.8 SV12.7 SV12.6 SV12.5 SV12.4 SV12.3 SV12.2 SV12.1 SV14.12 SV14.11 SV14.10 SV14.9 SV14.8 SV14.7 SV14.6 SV14.5 SV14.4 SV14.3 SV14.2 SV14.1 SV16.12 SV16.11 SV16.10 SV16.9 SV16.8 SV16.7 SV16.6 SV16.5 SV16.4 SV16.3 SV16.2 SV16.1 SV18.12 SV18.11 SV18.10 SV18.9 SV18.8 SV18.7 SV18.6 SV18.5 SV18.4 SV18.3 SV18.2 SV18.1 SV20.12 SV20.11 SV20.10 SV20.9 SV20.8 SV20.7 SV20.6 SV20.5 SV20.4 SV20.3 SV20.2 SV20.1 65.91,38.1 | SV12.11 SV12.12 65.91,194.31 | 91.31,38.1 SV30.1 SV30.2 SV30.3 SV30.4 SV30.5 SV30.6 SV30.7 SV30.8 SV30.9 SV30.10 SV30.11 SV30.12 SV28.1 SV28.2 SV28.3 SV28.4 SV28.5 SV28.6 SV28.7 SV28.8 SV28.9 SV28.10 SV28.11 SV28.12 SV26.1 SV26.2 SV26.3 SV26.4 SV26.5 SV26.6 SV26.7 SV26.8 SV26.9 SV26.10 SV26.11 SV26.12 SV24.1 SV24.2 SV24.3 SV24.4 SV24.5 SV24.6 SV24.7 SV24.8 SV24.9 SV24.10 SV24.11 SV24.12 SV22.1 SV22.2 SV22.3 SV22.4 SV22.5 SV22.6 SV22.7 SV22.8 SV22.9 SV22.10 SV22.11 SV22.12 91.31,194.31 | 116.71,38.1 SV40.1 SV40.2 SV40.3 SV40.4 SV40.5 SV40.6 SV40.7 SV40.8 SV40.9 SV40.10 SV40.11 SV40.12 SV38.1 SV38.2 SV38.3 SV38.4 SV38.5 SV38.6 SV38.7 SV38.8 SV38.9 SV38.10 SV38.11 SV38.12 SV36.1 SV36.2 SV36.3 SV36.4 SV36.5 SV36.6 SV36.7 SV36.8 SV36.9 SV36.10 SV36.11 SV36.12 SV34.1 SV34.2 SV34.3 SV34.4 SV34.5 SV34.6 SV34.7 SV34.8 SV34.9 SV34.10 SV34.11 SV34.12 SV32.1 SV32.2 SV32.3 SV32.4 SV32.5 SV32.6 SV32.7 SV32.8 SV32.9 SV32.10 SV32.11 SV32.12 116.71,194.31
  Bottom 0.813: 116.71,194.31 91.31,194.31 | 147.19,194.31 116.71,194.31 | 172.59,194.31 147.19,194.31 | 197.99,194.31 172.59,194.31 | 197.99,194.31 223.39,194.31 | 223.39,194.31 248.79,194.31 SV82.1 SV82.2 SV82.3 SV82.4 SV82.5 SV82.6 SV82.7 SV82.8 SV82.9 SV82.10 SV82.11 SV82.12 SV84.1 SV84.2 SV84.3 SV84.4 SV84.5 SV84.6 SV84.7 SV84.8 SV84.9 SV84.10 SV84.11 SV84.12 SV86.1 SV86.2 SV86.3 SV86.4 SV86.5 SV86.6 SV86.7 SV86.8 SV86.9 SV86.10 SV86.11 SV86.12 SV88.1 SV88.2 SV88.3 SV88.4 SV88.5 SV88.6 SV88.7 SV88.8 SV88.9 SV88.10 SV88.11 SV88.12 SV90.1 SV90.2 SV90.3 SV90.4 SV90.5 SV90.6 SV90.7 SV90.8 SV90.9 SV90.10 SV90.11 SV90.12 248.79,38.1 | 156.72,38.1 147.19,38.1 | 172.59,38.1 156.72,38.1 | 175.77,38.1 172.59,38.1 | 248.79,38.1 245.62,38.1 | 197.99,38.1 SV70.12 SV70.11 SV70.10 SV70.9 SV70.8 SV70.7 SV70.6 SV70.5 SV70.4 SV70.3 SV70.2 SV70.1 SV68.12 SV68.11 SV68.10 SV68.9 SV68.8 SV68.7 SV68.6 SV68.5 SV68.4 SV68.3 SV68.2 SV68.1 SV66.12 SV66.11 SV66.10 SV66.9 SV66.8 SV66.7 SV66.6 SV66.5 SV66.4 SV66.3 SV66.2 SV66.1 | 223.39,38.1 SV80.12 SV80.11 SV80.10 SV80.9 SV80.8 SV80.7 SV80.6 SV80.5 SV80.4 SV80.3 SV80.2 SV80.1 SV78.12 SV78.11 SV78.10 SV78.9 SV78.8 SV78.7 SV78.6 SV78.5 SV78.4 SV78.3 SV78.2 SV78.1 SV76.12 SV76.11 SV76.10 SV76.9 SV76.8 SV76.7 SV76.6 SV76.5 SV76.4 SV76.3 SV76.2 SV76.1 SV74.12 SV74.11 SV74.10 SV74.9 SV74.8 SV74.7 SV74.6 SV74.5 SV74.4 SV74.3 SV74.2 SV74.1 SV72.12 SV72.11 SV72.10 SV72.9 SV72.8 SV72.7 SV72.6 SV72.5 SV72.4 SV72.3 SV72.2 SV72.1 223.39,194.31 | 172.59,38.1 SV60.12 SV60.11 SV60.10 SV60.9 SV60.8 SV60.7 SV60.6 SV60.5 SV60.4 SV60.3 SV60.2 SV60.1 SV58.12 SV58.11 SV58.10 SV58.9 SV58.8 SV58.7 SV58.6 SV58.5 SV58.4 SV58.3 SV58.2 SV58.1 SV56.12 SV56.11 SV56.10 SV56.9 SV56.8 SV56.7 SV56.6 SV56.5 SV56.4 SV56.3 SV56.2 SV56.1 SV54.12 SV54.11 SV54.10 SV54.9 SV54.8 SV54.7 SV54.6 SV54.5 SV54.4 SV54.3 SV54.2 SV54.1 SV52.12 SV52.11 SV52.10 SV52.9 SV52.8 SV52.7 SV52.6 SV52.5 SV52.4 SV52.3 SV52.2 SV52.1 172.59,194.31
  Bottom 0.813: 147.19,38.1 SV50.12 SV50.11 SV50.10 SV50.9 SV50.8 SV50.7 SV50.6 SV50.5 SV50.4 SV50.3 SV50.2 SV50.1 SV48.12 SV48.11 SV48.10 SV48.9 SV48.8 SV48.7 SV48.6 SV48.5 SV48.4 SV48.3 SV48.2 SV48.1 SV46.12 SV46.11 SV46.10 SV46.9 SV46.8 SV46.7 SV46.6 SV46.5 SV46.4 SV46.3 SV46.2 SV46.1 SV44.12 SV44.11 SV44.10 SV44.9 SV44.8 SV44.7 SV44.6 SV44.5 SV44.4 SV44.3 SV44.2 SV44.1 SV42.12 SV42.11 SV42.10 SV42.9 SV42.8 SV42.7 SV42.6 SV42.5 SV42.4 SV42.3 SV42.2 SV42.1 147.19,194.31 | 197.99,194.31 SV62.1 SV62.2 SV62.3 SV62.4 SV62.5 SV62.6 SV62.7 SV62.8 SV62.9 SV62.10 SV62.11 SV62.12 SV64.1 SV64.2 SV64.3 SV64.4 SV64.5 SV64.6 SV64.7 SV64.8 SV64.9 SV64.10 SV64.11 SV66.1 | SV66.1 SV64.12 SV66.1 | 42.42,38.1 37.97,38.1 C1.- | 112.27,38.1 107.82,38.1 C2.- | 175.77,38.1 171.32,38.1 C3.- | 245.62,38.1 241.17,38.1 C4.-
  pour Bottom (isolate 0.813): 4.95,194.31 4.95,201.93 261.49,201.93 261.49,194.31
  pour Bottom (isolate 0.813): 4.95,33.02 4.95,38.1 261.49,38.1 261.49,33.02
INHIBIT
  Bottom 0.406: D10.13 224.66,24.13 224.66,15.88 223.39,14.61 U$2.AP2
INITIALIZE
  Top 0.406: D11.14 86.23,19.68 86.23,13.97 U$2.CR1
INT_IN_PROG
  Bottom 0.406: D8.13 151.64,23.5 151.64,15.88 152.91,14.61 U$2.BP2
INT_STROBE
  Bottom 0.406: D8.4 180.21,23.5 180.21,15.88 181.48,14.61 U$2.BD2
N$1
  Bottom 0.406: IC3.1 IC4.1 IC2.1 IC1.1
N$18
  Bottom 0.406: IC3.2 IC4.2 IC2.2 IC1.2
N$19
  Bottom 0.406: IC3.3 IC4.3 IC2.3 IC1.3
N$20
  Bottom 0.406: IC3.4 IC4.4 IC2.4 IC1.4
N$21
  Bottom 0.406: IC3.5 IC4.5 IC2.5 IC1.5
N$22
  Bottom 0.406: IC3.6 IC4.6 IC2.6 IC1.6
N$23
  Bottom 0.406: IC3.7 IC4.7 IC2.7 IC1.7
N$24
  Bottom 0.406: IC3.8 IC4.8 IC2.8 IC1.8
N$25
  Bottom 0.406: IC3.9 IC4.9 IC2.9 IC1.9
N$26
  Bottom 0.406: IC3.10 IC4.10 IC2.10 IC1.10
N$27
  Bottom 0.406: IC3.11 IC4.11 IC2.11 IC1.11
N$28
  Bottom 0.406: IC3.12 IC4.12 IC2.12 IC1.12
N$29
  Bottom 0.406: IC1.13 IC4.13 IC2.13 IC3.13
N$30
  Bottom 0.406: IC1.14 IC4.14 IC2.14 IC3.14
N$31
  Bottom 0.406: IC1.15 IC4.15 IC2.15 IC3.15
N$32
  Bottom 0.406: IC1.16 IC4.16 IC2.16 IC3.16
N$33
  Bottom 0.406: IC1.17 IC4.17 IC2.17 IC3.17
N$34
  Bottom 0.406: IC32.1 IC31.1 IC33.1 IC30.1
N$35
  Bottom 0.406: IC1.18 IC4.18 IC2.18 IC3.18
N$36
  Bottom 0.406: IC1.19 IC4.19 IC2.19 IC3.19
N$37
  Bottom 0.406: IC1.20 IC4.20 IC2.20 IC3.20
N$38
  Bottom 0.406: IC1.21 IC4.21 IC2.21 IC3.21
N$39
  Bottom 0.406: IC1.22 IC4.22 IC2.22 IC3.22
N$40
  Bottom 0.406: IC32.2 IC31.2 IC33.2 IC30.2
N$41
  Bottom 0.406: IC32.3 IC31.3 IC33.3 IC30.3
N$42
  Bottom 0.406: IC32.4 IC31.4 IC33.4 IC30.4
N$43
  Bottom 0.406: IC32.5 IC31.5 IC33.5 IC30.5
N$44
  Bottom 0.406: IC32.6 IC31.6 IC33.6 IC30.6
N$45
  Bottom 0.406: IC32.7 IC31.7 IC33.7 IC30.7
N$46
  Top 0.406: D9.2 257.68,19.68 257.68,13.97 U$2.AB1
N$47
  Top 0.406: D9.1 260.86,19.68 260.86,13.97 U$2.AA1
N$48
  Top 0.406: D7.2 187.83,19.68 187.83,13.97 U$2.BB1
N$49
  Top 0.406: D7.1 191.01,19.68 191.01,13.97 U$2.BA1
N$50
  Top 0.406: D11.1 127.51,19.68 127.51,13.97 U$2.CA1
N$51
  Bottom 0.406: D8.15 145.29,23.5 145.29,15.88 146.56,14.61 U$2.BS2
N$52
  Top 0.406: D11.2 124.33,19.68 124.33,13.97 U$2.CB1
N$53
  Top 0.406: D13.1 57.66,19.68 57.66,13.97 U$2.DA1
N$54
  Top 0.406: D13.2 54.48,19.68 54.48,13.97 U$2.DB1
N$55
  Bottom 0.406: IC12.1 IC11.1 IC13.1 IC10.1
N$56
  Bottom 0.406: IC12.2 IC11.2 IC13.2 IC10.2
N$57
  Bottom 0.406: IC12.3 IC11.3 IC13.3 IC10.3
N$58
  Bottom 0.406: IC12.4 IC11.4 IC13.4 IC10.4
N$59
  Bottom 0.406: IC12.5 IC11.5 IC13.5 IC10.5
N$60
  Bottom 0.406: IC12.6 IC11.6 IC13.6 IC10.6
N$61
  Bottom 0.406: IC12.7 IC11.7 IC13.7 IC10.7
N$62
  Bottom 0.406: IC12.8 IC11.8 IC13.8 IC10.8
N$63
  Bottom 0.406: IC12.9 IC11.9 IC13.9 IC10.9
N$64
  Bottom 0.406: IC12.10 IC11.10 IC13.10 IC10.10
N$65
  Bottom 0.406: IC12.11 IC11.11 IC13.11 IC10.11
N$66
  Bottom 0.406: IC12.12 IC11.12 IC13.12 IC10.12
N$67
  Bottom 0.406: IC10.13 IC11.13 IC13.13 IC12.13
N$68
  Bottom 0.406: IC10.14 IC11.14 IC13.14 IC12.14
N$69
  Bottom 0.406: IC10.15 IC11.15 IC13.15 IC12.15
N$70
  Bottom 0.406: IC10.16 IC11.16 IC13.16 IC12.16
N$71
  Bottom 0.406: IC10.17 IC11.17 IC13.17 IC12.17
N$72
  Bottom 0.406: IC10.18 IC11.18 IC13.18 IC12.18
N$73
  Bottom 0.406: IC10.19 IC11.19 IC13.19 IC12.19
N$74
  Bottom 0.406: IC10.20 IC11.20 IC13.20 IC12.20
N$75
  Bottom 0.406: IC10.21 IC11.21 IC13.21 IC12.21
N$76
  Bottom 0.406: IC10.22 IC11.22 IC13.22 IC12.22
N$77
  Bottom 0.406: IC10.23 IC11.23 IC13.23 IC12.23
N$78
  Bottom 0.406: IC10.24 IC11.24 IC13.24 IC12.24
N$79
  Bottom 0.406: IC16.1 IC15.1 IC17.1 IC14.1
N$80
  Bottom 0.406: IC16.2 IC15.2 IC17.2 IC14.2
N$81
  Bottom 0.406: IC16.3 IC15.3 IC17.3 IC14.3
N$82
  Bottom 0.406: IC16.4 IC15.4 IC17.4 IC14.4
N$83
  Bottom 0.406: IC16.5 IC15.5 IC17.5 IC14.5
N$84
  Bottom 0.406: IC16.6 IC15.6 IC17.6 IC14.6
N$85
  Bottom 0.406: IC16.7 IC15.7 IC17.7 IC14.7
N$86
  Bottom 0.406: IC16.8 IC15.8 IC17.8 IC14.8
N$87
  Bottom 0.406: IC16.9 IC15.9 IC17.9 IC14.9
N$88
  Bottom 0.406: IC16.10 IC15.10 IC17.10 IC14.10
N$89
  Bottom 0.406: IC16.11 IC15.11 IC17.11 IC14.11
N$90
  Bottom 0.406: IC16.12 IC15.12 IC17.12 IC14.12
N$91
  Bottom 0.406: IC14.13 IC15.13 IC17.13 IC16.13
N$92
  Bottom 0.406: IC14.14 IC15.14 IC17.14 IC16.14
N$93
  Bottom 0.406: IC14.15 IC15.15 IC17.15 IC16.15
N$94
  Bottom 0.406: IC14.16 IC15.16 IC17.16 IC16.16
N$95
  Bottom 0.406: IC14.17 IC15.17 IC17.17 IC16.17
N$96
  Bottom 0.406: IC14.18 IC15.18 IC17.18 IC16.18
N$97
  Bottom 0.406: IC14.19 IC15.19 IC17.19 IC16.19
N$98
  Bottom 0.406: IC14.20 IC15.20 IC17.20 IC16.20
N$99
  Bottom 0.406: IC14.21 IC15.21 IC17.21 IC16.21
N$100
  Bottom 0.406: IC14.22 IC15.22 IC17.22 IC16.22
N$101
  Bottom 0.406: IC14.23 IC15.23 IC17.23 IC16.23
N$102
  Bottom 0.406: IC14.24 IC15.24 IC17.24 IC16.24
N$103
  Bottom 0.406: IC20.1 IC19.1 IC21.1 IC18.1
N$104
  Bottom 0.406: IC20.2 IC19.2 IC21.2 IC18.2
N$105
  Bottom 0.406: IC20.3 IC19.3 IC21.3 IC18.3
N$106
  Bottom 0.406: IC20.4 IC19.4 IC21.4 IC18.4
N$107
  Bottom 0.406: IC20.5 IC19.5 IC21.5 IC18.5
N$108
  Bottom 0.406: IC20.6 IC19.6 IC21.6 IC18.6
N$109
  Bottom 0.406: IC20.7 IC19.7 IC21.7 IC18.7
N$110
  Bottom 0.406: IC20.8 IC19.8 IC21.8 IC18.8
N$111
  Bottom 0.406: IC20.9 IC19.9 IC21.9 IC18.9
N$112
  Bottom 0.406: IC20.10 IC19.10 IC21.10 IC18.10
N$113
  Bottom 0.406: IC20.11 IC19.11 IC21.11 IC18.11
N$114
  Bottom 0.406: IC20.12 IC19.12 IC21.12 IC18.12
N$115
  Bottom 0.406: IC18.13 IC19.13 IC21.13 IC20.13
N$116
  Bottom 0.406: IC18.14 IC19.14 IC21.14 IC20.14
N$117
  Bottom 0.406: IC18.15 IC19.15 IC21.15 IC20.15
N$118
  Bottom 0.406: IC18.16 IC19.16 IC21.16 IC20.16
N$119
  Bottom 0.406: IC18.17 IC19.17 IC21.17 IC20.17
N$120
  Bottom 0.406: IC18.18 IC19.18 IC21.18 IC20.18
N$121
  Bottom 0.406: IC18.19 IC19.19 IC21.19 IC20.19
N$122
  Bottom 0.406: IC18.20 IC19.20 IC21.20 IC20.20
N$123
  Bottom 0.406: IC18.21 IC19.21 IC21.21 IC20.21
N$124
  Bottom 0.406: IC18.22 IC19.22 IC21.22 IC20.22
N$125
  Bottom 0.406: IC18.23 IC19.23 IC21.23 IC20.23
N$126
  Bottom 0.406: IC18.24 IC19.24 IC21.24 IC20.24
N$127
  Bottom 0.406: IC24.1 IC23.1 IC25.1 IC22.1
N$128
  Bottom 0.406: IC24.2 IC23.2 IC25.2 IC22.2
N$129
  Bottom 0.406: IC24.3 IC23.3 IC25.3 IC22.3
N$130
  Bottom 0.406: IC24.4 IC23.4 IC25.4 IC22.4
N$131
  Bottom 0.406: IC24.5 IC23.5 IC25.5 IC22.5
N$132
  Bottom 0.406: IC24.6 IC23.6 IC25.6 IC22.6
N$133
  Bottom 0.406: IC24.7 IC23.7 IC25.7 IC22.7
N$134
  Bottom 0.406: IC24.8 IC23.8 IC25.8 IC22.8
N$135
  Bottom 0.406: IC24.9 IC23.9 IC25.9 IC22.9
N$136
  Bottom 0.406: IC24.10 IC23.10 IC25.10 IC22.10
N$137
  Bottom 0.406: IC24.11 IC23.11 IC25.11 IC22.11
N$138
  Bottom 0.406: IC24.12 IC23.12 IC25.12 IC22.12
N$139
  Bottom 0.406: IC22.13 IC23.13 IC25.13 IC24.13
N$140
  Bottom 0.406: IC22.14 IC23.14 IC25.14 IC24.14
N$141
  Bottom 0.406: IC22.15 IC23.15 IC25.15 IC24.15
N$142
  Bottom 0.406: IC22.16 IC23.16 IC25.16 IC24.16
N$143
  Bottom 0.406: IC22.17 IC23.17 IC25.17 IC24.17
N$144
  Bottom 0.406: IC22.18 IC23.18 IC25.18 IC24.18
N$145
  Bottom 0.406: IC22.19 IC23.19 IC25.19 IC24.19
N$146
  Bottom 0.406: IC22.20 IC23.20 IC25.20 IC24.20
N$147
  Bottom 0.406: IC22.21 IC23.21 IC25.21 IC24.21
N$148
  Bottom 0.406: IC22.22 IC23.22 IC25.22 IC24.22
N$149
  Bottom 0.406: IC22.23 IC23.23 IC25.23 IC24.23
N$150
  Bottom 0.406: IC22.24 IC23.24 IC25.24 IC24.24
N$151
  Bottom 0.406: IC28.1 IC27.1 IC29.1 IC26.1
N$152
  Bottom 0.406: IC28.2 IC27.2 IC29.2 IC26.2
N$153
  Bottom 0.406: IC28.3 IC27.3 IC29.3 IC26.3
N$154
  Bottom 0.406: IC28.4 IC27.4 IC29.4 IC26.4
N$155
  Bottom 0.406: IC28.5 IC27.5 IC29.5 IC26.5
N$156
  Bottom 0.406: IC28.6 IC27.6 IC29.6 IC26.6
N$157
  Bottom 0.406: IC28.7 IC27.7 IC29.7 IC26.7
N$158
  Bottom 0.406: IC28.8 IC27.8 IC29.8 IC26.8
N$159
  Bottom 0.406: IC28.9 IC27.9 IC29.9 IC26.9
N$160
  Bottom 0.406: IC28.10 IC27.10 IC29.10 IC26.10
N$161
  Bottom 0.406: IC28.11 IC27.11 IC29.11 IC26.11
N$162
  Bottom 0.406: IC28.12 IC27.12 IC29.12 IC26.12
N$163
  Bottom 0.406: IC26.13 IC27.13 IC29.13 IC28.13
N$164
  Bottom 0.406: IC26.14 IC27.14 IC29.14 IC28.14
N$165
  Bottom 0.406: IC26.15 IC27.15 IC29.15 IC28.15
N$166
  Bottom 0.406: IC26.16 IC27.16 IC29.16 IC28.16
N$167
  Bottom 0.406: IC26.17 IC27.17 IC29.17 IC28.17
N$168
  Bottom 0.406: IC26.18 IC27.18 IC29.18 IC28.18
N$169
  Bottom 0.406: IC26.19 IC27.19 IC29.19 IC28.19
N$170
  Bottom 0.406: IC26.20 IC27.20 IC29.20 IC28.20
N$171
  Bottom 0.406: IC26.21 IC27.21 IC29.21 IC28.21
N$172
  Bottom 0.406: IC26.22 IC27.22 IC29.22 IC28.22
N$173
  Bottom 0.406: IC26.23 IC27.23 IC29.23 IC28.23
N$174
  Bottom 0.406: IC26.24 IC27.24 IC29.24 IC28.24
N$175
  Bottom 0.406: IC32.8 IC31.8 IC33.8 IC30.8
N$176
  Bottom 0.406: IC32.9 IC31.9 IC33.9 IC30.9
N$177
  Bottom 0.406: IC32.10 IC31.10 IC33.10 IC30.10
N$178
  Bottom 0.406: IC32.11 IC31.11 IC33.11 IC30.11
N$179
  Bottom 0.406: IC32.12 IC31.12 IC33.12 IC30.12
N$180
  Bottom 0.406: IC30.13 IC31.13 IC33.13 IC32.13
N$181
  Bottom 0.406: IC30.14 IC31.14 IC33.14 IC32.14
N$182
  Bottom 0.406: IC30.15 IC31.15 IC33.15 IC32.15
N$183
  Bottom 0.406: IC30.16 IC31.16 IC33.16 IC32.16
N$184
  Bottom 0.406: IC30.17 IC31.17 IC33.17 IC32.17
N$185
  Bottom 0.406: IC30.18 IC31.18 IC33.18 IC32.18
N$186
  Bottom 0.406: IC30.19 IC31.19 IC33.19 IC32.19
N$187
  Bottom 0.406: IC30.20 IC31.20 IC33.20 IC32.20
N$188
  Bottom 0.406: IC30.21 IC31.21 IC33.21 IC32.21
N$189
  Bottom 0.406: IC30.22 IC31.22 IC33.22 IC32.22
N$190
  Bottom 0.406: IC30.23 IC31.23 IC33.23 IC32.23
N$191
  Bottom 0.406: IC30.24 IC31.24 IC33.24 IC32.24
N$192
  Bottom 0.406: IC36.1 IC35.1 IC37.1 IC34.1
N$193
  Bottom 0.406: IC36.2 IC35.2 IC37.2 IC34.2
N$194
  Bottom 0.406: IC36.3 IC35.3 IC37.3 IC34.3
N$195
  Bottom 0.406: IC36.4 IC35.4 IC37.4 IC34.4
N$196
  Bottom 0.406: IC36.5 IC35.5 IC37.5 IC34.5
N$197
  Bottom 0.406: IC36.6 IC35.6 IC37.6 IC34.6
N$198
  Bottom 0.406: IC36.7 IC35.7 IC37.7 IC34.7
N$199
  Bottom 0.406: IC36.8 IC35.8 IC37.8 IC34.8
N$200
  Bottom 0.406: IC36.9 IC35.9 IC37.9 IC34.9
N$201
  Bottom 0.406: IC36.10 IC35.10 IC37.10 IC34.10
N$202
  Bottom 0.406: IC36.11 IC35.11 IC37.11 IC34.11
N$203
  Bottom 0.406: IC36.12 IC35.12 IC37.12 IC34.12
N$204
  Bottom 0.406: IC34.13 IC35.13 IC37.13 IC36.13
N$205
  Bottom 0.406: IC34.14 IC35.14 IC37.14 IC36.14
N$206
  Bottom 0.406: IC34.15 IC35.15 IC37.15 IC36.15
N$207
  Bottom 0.406: IC34.16 IC35.16 IC37.16 IC36.16
N$208
  Bottom 0.406: IC34.17 IC35.17 IC37.17 IC36.17
N$209
  Bottom 0.406: IC34.18 IC35.18 IC37.18 IC36.18
N$210
  Bottom 0.406: IC34.19 IC35.19 IC37.19 IC36.19
N$211
  Bottom 0.406: IC34.20 IC35.20 IC37.20 IC36.20
N$212
  Bottom 0.406: IC34.21 IC35.21 IC37.21 IC36.21
N$213
  Bottom 0.406: IC34.22 IC35.22 IC37.22 IC36.22
N$214
  Bottom 0.406: IC34.23 IC35.23 IC37.23 IC36.23
N$215
  Bottom 0.406: IC34.24 IC35.24 IC37.24 IC36.24
N$216
  Bottom 0.406: IC40.1 IC39.1 IC41.1 IC38.1
N$217
  Bottom 0.406: IC40.2 IC39.2 IC41.2 IC38.2
N$218
  Bottom 0.406: IC40.3 IC39.3 IC41.3 IC38.3
N$219
  Bottom 0.406: IC40.4 IC39.4 IC41.4 IC38.4
N$220
  Bottom 0.406: IC40.5 IC39.5 IC41.5 IC38.5
N$221
  Bottom 0.406: IC40.6 IC39.6 IC41.6 IC38.6
N$222
  Bottom 0.406: IC40.7 IC39.7 IC41.7 IC38.7
N$223
  Bottom 0.406: IC40.8 IC39.8 IC41.8 IC38.8
N$224
  Bottom 0.406: IC40.9 IC39.9 IC41.9 IC38.9
N$225
  Bottom 0.406: IC40.10 IC39.10 IC41.10 IC38.10
N$226
  Bottom 0.406: IC40.11 IC39.11 IC41.11 IC38.11
N$227
  Bottom 0.406: IC40.12 IC39.12 IC41.12 IC38.12
N$228
  Bottom 0.406: IC38.13 IC39.13 IC41.13 IC40.13
N$229
  Bottom 0.406: IC38.14 IC39.14 IC41.14 IC40.14
N$230
  Bottom 0.406: IC38.15 IC39.15 IC41.15 IC40.15
N$231
  Bottom 0.406: IC38.16 IC39.16 IC41.16 IC40.16
N$232
  Bottom 0.406: IC38.17 IC39.17 IC41.17 IC40.17
N$233
  Bottom 0.406: IC38.18 IC39.18 IC41.18 IC40.18
N$234
  Bottom 0.406: IC38.19 IC39.19 IC41.19 IC40.19
N$235
  Bottom 0.406: IC38.20 IC39.20 IC41.20 IC40.20
N$236
  Bottom 0.406: IC38.21 IC39.21 IC41.21 IC40.21
N$237
  Bottom 0.406: IC38.22 IC39.22 IC41.22 IC40.22
N$238
  Bottom 0.406: IC38.23 IC39.23 IC41.23 IC40.23
N$239
  Bottom 0.406: IC38.24 IC39.24 IC41.24 IC40.24
N$240
  Bottom 0.406: IC44.1 IC43.1 IC45.1 IC42.1
N$241
  Bottom 0.406: IC44.2 IC43.2 IC45.2 IC42.2
N$242
  Bottom 0.406: IC44.3 IC43.3 IC45.3 IC42.3
N$243
  Bottom 0.406: IC44.4 IC43.4 IC45.4 IC42.4
N$244
  Bottom 0.406: IC44.5 IC43.5 IC45.5 IC42.5
N$245
  Bottom 0.406: IC44.6 IC43.6 IC45.6 IC42.6
N$246
  Bottom 0.406: IC44.7 IC43.7 IC45.7 IC42.7
N$247
  Bottom 0.406: IC44.8 IC43.8 IC45.8 IC42.8
N$248
  Bottom 0.406: IC44.9 IC43.9 IC45.9 IC42.9
N$249
  Bottom 0.406: IC44.10 IC43.10 IC45.10 IC42.10
N$250
  Bottom 0.406: IC44.11 IC43.11 IC45.11 IC42.11
N$251
  Bottom 0.406: IC44.12 IC43.12 IC45.12 IC42.12
N$252
  Bottom 0.406: IC42.13 IC43.13 IC45.13 IC44.13
N$253
  Bottom 0.406: IC42.14 IC43.14 IC45.14 IC44.14
N$254
  Bottom 0.406: IC42.15 IC43.15 IC45.15 IC44.15
N$255
  Bottom 0.406: IC42.16 IC43.16 IC45.16 IC44.16
N$256
  Bottom 0.406: IC42.17 IC43.17 IC45.17 IC44.17
N$257
  Bottom 0.406: IC42.18 IC43.18 IC45.18 IC44.18
N$258
  Bottom 0.406: IC42.19 IC43.19 IC45.19 IC44.19
N$259
  Bottom 0.406: IC42.20 IC43.20 IC45.20 IC44.20
N$260
  Bottom 0.406: IC42.21 IC43.21 IC45.21 IC44.21
N$261
  Bottom 0.406: IC42.22 IC43.22 IC45.22 IC44.22
N$262
  Bottom 0.406: IC42.23 IC43.23 IC45.23 IC44.23
N$263
  Bottom 0.406: IC42.24 IC43.24 IC45.24 IC44.24
N$264
  Bottom 0.406: IC48.1 IC47.1 IC49.1 IC46.1
N$265
  Bottom 0.406: IC48.2 IC47.2 IC49.2 IC46.2
N$266
  Bottom 0.406: IC48.3 IC47.3 IC49.3 IC46.3
N$267
  Bottom 0.406: IC48.4 IC47.4 IC49.4 IC46.4
N$268
  Bottom 0.406: IC48.5 IC47.5 IC49.5 IC46.5
N$269
  Bottom 0.406: IC48.6 IC47.6 IC49.6 IC46.6
N$270
  Bottom 0.406: IC48.7 IC47.7 IC49.7 IC46.7
N$271
  Bottom 0.406: IC48.8 IC47.8 IC49.8 IC46.8
N$272
  Bottom 0.406: IC48.9 IC47.9 IC49.9 IC46.9
N$273
  Bottom 0.406: IC48.10 IC47.10 IC49.10 IC46.10
N$274
  Bottom 0.406: IC48.11 IC47.11 IC49.11 IC46.11
N$275
  Bottom 0.406: IC48.12 IC47.12 IC49.12 IC46.12
N$276
  Bottom 0.406: IC46.13 IC47.13 IC49.13 IC48.13
N$277
  Bottom 0.406: IC46.14 IC47.14 IC49.14 IC48.14
N$278
  Bottom 0.406: IC46.15 IC47.15 IC49.15 IC48.15
N$279
  Bottom 0.406: IC46.16 IC47.16 IC49.16 IC48.16
N$280
  Bottom 0.406: IC46.17 IC47.17 IC49.17 IC48.17
N$281
  Bottom 0.406: IC46.18 IC47.18 IC49.18 IC48.18
N$282
  Bottom 0.406: IC46.19 IC47.19 IC49.19 IC48.19
N$283
  Bottom 0.406: IC46.20 IC47.20 IC49.20 IC48.20
N$284
  Bottom 0.406: IC46.21 IC47.21 IC49.21 IC48.21
N$285
  Bottom 0.406: IC46.22 IC47.22 IC49.22 IC48.22
N$286
  Bottom 0.406: IC46.23 IC47.23 IC49.23 IC48.23
N$287
  Bottom 0.406: IC46.24 IC47.24 IC49.24 IC48.24
N$288
  Bottom 0.406: IC52.1 IC51.1 IC53.1 IC50.1
N$289
  Bottom 0.406: IC52.2 IC51.2 IC53.2 IC50.2
N$290
  Bottom 0.406: IC52.3 IC51.3 IC53.3 IC50.3
N$291
  Bottom 0.406: IC52.4 IC51.4 IC53.4 IC50.4
N$292
  Bottom 0.406: IC52.5 IC51.5 IC53.5 IC50.5
N$293
  Bottom 0.406: IC52.6 IC51.6 IC53.6 IC50.6
N$294
  Bottom 0.406: IC52.7 IC51.7 IC53.7 IC50.7
N$295
  Bottom 0.406: IC52.8 IC51.8 IC53.8 IC50.8
N$296
  Bottom 0.406: IC52.9 IC51.9 IC53.9 IC50.9
N$297
  Bottom 0.406: IC52.10 IC51.10 IC53.10 IC50.10
N$298
  Bottom 0.406: IC52.11 IC51.11 IC53.11 IC50.11
N$299
  Bottom 0.406: IC52.12 IC51.12 IC53.12 IC50.12
N$300
  Bottom 0.406: IC50.13 IC51.13 IC53.13 IC52.13
N$301
  Bottom 0.406: IC50.14 IC51.14 IC53.14 IC52.14
N$302
  Bottom 0.406: IC50.15 IC51.15 IC53.15 IC52.15
N$303
  Bottom 0.406: IC50.16 IC51.16 IC53.16 IC52.16
N$304
  Bottom 0.406: IC50.17 IC51.17 IC53.17 IC52.17
N$305
  Bottom 0.406: IC50.18 IC51.18 IC53.18 IC52.18
N$306
  Bottom 0.406: IC50.19 IC51.19 IC53.19 IC52.19
N$307
  Bottom 0.406: IC50.20 IC51.20 IC53.20 IC52.20
N$308
  Bottom 0.406: IC50.21 IC51.21 IC53.21 IC52.21
N$309
  Bottom 0.406: IC50.22 IC51.22 IC53.22 IC52.22
N$310
  Bottom 0.406: IC50.23 IC51.23 IC53.23 IC52.23
N$311
  Bottom 0.406: IC50.24 IC51.24 IC53.24 IC52.24
N$312
  Bottom 0.406: IC56.1 IC55.1 IC57.1 IC54.1
N$313
  Bottom 0.406: IC56.2 IC55.2 IC57.2 IC54.2
N$314
  Bottom 0.406: IC56.3 IC55.3 IC57.3 IC54.3
N$315
  Bottom 0.406: IC56.4 IC55.4 IC57.4 IC54.4
N$316
  Bottom 0.406: IC56.5 IC55.5 IC57.5 IC54.5
N$317
  Bottom 0.406: IC56.6 IC55.6 IC57.6 IC54.6
N$318
  Bottom 0.406: IC56.7 IC55.7 IC57.7 IC54.7
N$319
  Bottom 0.406: IC56.8 IC55.8 IC57.8 IC54.8
N$320
  Bottom 0.406: IC56.9 IC55.9 IC57.9 IC54.9
N$321
  Bottom 0.406: IC56.10 IC55.10 IC57.10 IC54.10
N$322
  Bottom 0.406: IC56.11 IC55.11 IC57.11 IC54.11
N$323
  Bottom 0.406: IC56.12 IC55.12 IC57.12 IC54.12
N$324
  Bottom 0.406: IC54.13 IC55.13 IC57.13 IC56.13
N$325
  Bottom 0.406: IC54.14 IC55.14 IC57.14 IC56.14
N$326
  Bottom 0.406: IC54.15 IC55.15 IC57.15 IC56.15
N$327
  Bottom 0.406: IC54.16 IC55.16 IC57.16 IC56.16
N$328
  Bottom 0.406: IC54.17 IC55.17 IC57.17 IC56.17
N$329
  Bottom 0.406: IC54.18 IC55.18 IC57.18 IC56.18
N$330
  Bottom 0.406: IC54.19 IC55.19 IC57.19 IC56.19
N$331
  Bottom 0.406: IC54.20 IC55.20 IC57.20 IC56.20
N$332
  Bottom 0.406: IC54.21 IC55.21 IC57.21 IC56.21
N$333
  Bottom 0.406: IC54.22 IC55.22 IC57.22 IC56.22
N$334
  Bottom 0.406: IC54.23 IC55.23 IC57.23 IC56.23
N$335
  Bottom 0.406: IC54.24 IC55.24 IC57.24 IC56.24
N$336
  Bottom 0.406: IC60.1 IC59.1 IC61.1 IC58.1
N$337
  Bottom 0.406: IC60.2 IC59.2 IC61.2 IC58.2
N$338
  Bottom 0.406: IC60.3 IC59.3 IC61.3 IC58.3
N$339
  Bottom 0.406: IC60.4 IC59.4 IC61.4 IC58.4
N$340
  Bottom 0.406: IC60.5 IC59.5 IC61.5 IC58.5
N$341
  Bottom 0.406: IC60.6 IC59.6 IC61.6 IC58.6
N$342
  Bottom 0.406: IC60.7 IC59.7 IC61.7 IC58.7
N$343
  Bottom 0.406: IC60.8 IC59.8 IC61.8 IC58.8
N$344
  Bottom 0.406: IC60.9 IC59.9 IC61.9 IC58.9
N$345
  Bottom 0.406: IC60.10 IC59.10 IC61.10 IC58.10
N$346
  Bottom 0.406: IC60.11 IC59.11 IC61.11 IC58.11
N$347
  Bottom 0.406: IC60.12 IC59.12 IC61.12 IC58.12
N$348
  Bottom 0.406: IC58.13 IC59.13 IC61.13 IC60.13
N$349
  Bottom 0.406: IC58.14 IC59.14 IC61.14 IC60.14
N$350
  Bottom 0.406: IC58.15 IC59.15 IC61.15 IC60.15
N$351
  Bottom 0.406: IC58.16 IC59.16 IC61.16 IC60.16
N$352
  Bottom 0.406: IC58.17 IC59.17 IC61.17 IC60.17
N$353
  Bottom 0.406: IC58.18 IC59.18 IC61.18 IC60.18
N$354
  Bottom 0.406: IC58.19 IC59.19 IC61.19 IC60.19
N$355
  Bottom 0.406: IC58.20 IC59.20 IC61.20 IC60.20
N$356
  Bottom 0.406: IC58.21 IC59.21 IC61.21 IC60.21
N$357
  Bottom 0.406: IC58.22 IC59.22 IC61.22 IC60.22
N$358
  Bottom 0.406: IC58.23 IC59.23 IC61.23 IC60.23
N$359
  Bottom 0.406: IC58.24 IC59.24 IC61.24 IC60.24
N$360
  Bottom 0.406: IC64.1 IC63.1 IC65.1 IC62.1
N$361
  Bottom 0.406: IC64.2 IC63.2 IC65.2 IC62.2
N$362
  Bottom 0.406: IC64.3 IC63.3 IC65.3 IC62.3
N$363
  Bottom 0.406: IC64.4 IC63.4 IC65.4 IC62.4
N$364
  Bottom 0.406: IC64.5 IC63.5 IC65.5 IC62.5
N$365
  Bottom 0.406: IC64.6 IC63.6 IC65.6 IC62.6
N$366
  Bottom 0.406: IC64.7 IC63.7 IC65.7 IC62.7
N$367
  Bottom 0.406: IC64.8 IC63.8 IC65.8 IC62.8
N$368
  Bottom 0.406: IC64.9 IC63.9 IC65.9 IC62.9
N$369
  Bottom 0.406: IC64.10 IC63.10 IC65.10 IC62.10
N$370
  Bottom 0.406: IC64.11 IC63.11 IC65.11 IC62.11
N$371
  Bottom 0.406: IC64.12 IC63.12 IC65.12 IC62.12
N$372
  Bottom 0.406: IC62.13 IC63.13 IC65.13 IC64.13
N$373
  Bottom 0.406: IC62.14 IC63.14 IC65.14 IC64.14
N$374
  Bottom 0.406: IC62.15 IC63.15 IC65.15 IC64.15
N$375
  Bottom 0.406: IC62.16 IC63.16 IC65.16 IC64.16
N$376
  Bottom 0.406: IC62.17 IC63.17 IC65.17 IC64.17
N$377
  Bottom 0.406: IC62.18 IC63.18 IC65.18 IC64.18
N$378